# Altium project FPGA_Module.PrjPcb
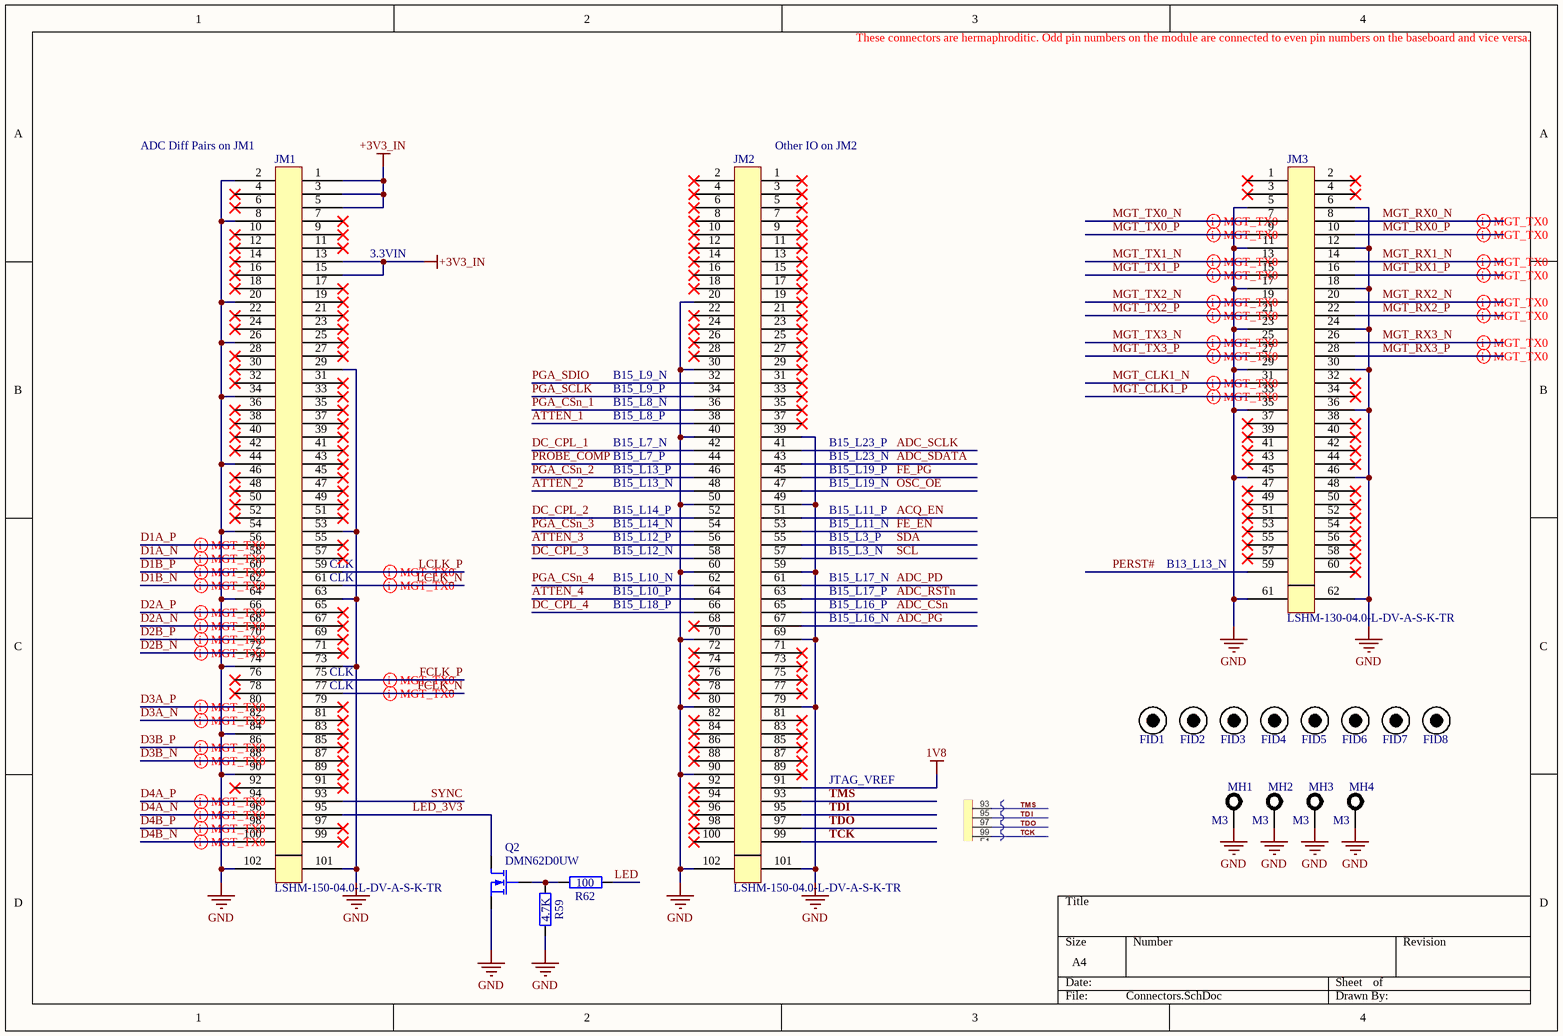
[diagram p0: Connectors.SchDoc]
8 sheets, 195 parts. Net scope: global (net labels, ports and power ports of the same name join across sheets).
Board files: FPGA_Module.PcbDoc, FPGA_Module_Panel.PcbDoc
Sheets:
  Connectors.SchDoc
  FPGA_Bank_IO.SchDoc
  FPGA_Banks_DDR3.SchDoc
  FPGA_MGT.SchDoc
  FPGA_CFG.SchDoc
  FPGA_PWR.SchDoc
  DDR3L.SchDoc
  PWR.SchDoc

## Sheet Connectors.SchDoc
size A4; SheetNumber: 1; SheetTotal: 8

### Parts
FID1  PCB  [GEN_FID]  (value not drawn)  (no BOM)
FID2  PCB  [GEN_FID]  (value not drawn)  (no BOM)
FID3  PCB  [GEN_FID]  (value not drawn)  (no BOM)
FID4  PCB  [GEN_FID]  (value not drawn)  (no BOM)
FID5  PCB  [GEN_FID]  (value not drawn)  (no BOM)
FID6  PCB  [GEN_FID]  (value not drawn)  (no BOM)
FID7  PCB  [GEN_FID]  (value not drawn)  (no BOM)
FID8  PCB  [GEN_FID]  (value not drawn)  (no BOM)
JM1  LSHM-150-04.0-L-DV-A-S-K-TR  [SAM_LSHM-150-XX.X-XX-DV-A-S]
JM2  LSHM-150-04.0-L-DV-A-S-K-TR  [SAM_LSHM-150-XX.X-XX-DV-A-S]
JM3  LSHM-130-04.0-L-DV-A-S-K-TR  [SAM_LSHM-130-XX.X-XX-DV-A-S]
MH1  M3  [MH M3]  (no BOM)
MH2  M3  [MH M3]  (no BOM)
MH3  M3  [MH M3]  (no BOM)
MH4  M3  [MH M3]  (no BOM)
Q2  DMN62D0UW  [GEN_SOT_323]
R59  4.7K  [GEN_R_0201]
R62  100  [GEN_R_0201]

### Nets
1V8: JM2.91
+3V3_IN: JM1.1 JM1.3 JM1.5 JM1.13 JM1.15
GND: JM1.2 JM1.8 JM1.20 JM1.26 JM1.29 JM1.34 JM1.44 JM1.53 JM1.54 JM1.63 JM1.64 JM1.73 JM1.74 JM1.84 JM1.90 JM1.101 JM1.102 JM2.20 JM2.30 JM2.39 JM2.40 JM2.49 JM2.50 JM2.59 JM2.60 JM2.69 JM2.70 JM2.79 JM2.80 JM2.90 JM2.101 JM2.102 JM3.5 JM3.6 JM3.11 JM3.12 JM3.17 JM3.18 JM3.23 JM3.24 JM3.29 JM3.30 JM3.35 JM3.36 JM3.45 JM3.46 JM3.61 JM3.62 MH1.1 MH2.1 MH3.1 MH4.1 Q2.3(S) R59.2
ACQ_EN: JM2.51
ADC_CSn: JM2.65
ADC_PD: JM2.61
ADC_PG: JM2.67
ADC_RSTn: JM2.63
ADC_SCLK: JM2.41
ADC_SDATA: JM2.43
ATTEN_1: JM2.38
ATTEN_2: JM2.48
ATTEN_3: JM2.56
ATTEN_4: JM2.64
D1A_N: JM1.58
D1A_P: JM1.56
D1B_N: JM1.62
D1B_P: JM1.60
D2A_N: JM1.68
D2A_P: JM1.66
D2B_N: JM1.72
D2B_P: JM1.70
D3A_N: JM1.82
D3A_P: JM1.80
D3B_N: JM1.88
D3B_P: JM1.86
D4A_N: JM1.96
D4A_P: JM1.94
D4B_N: JM1.100
D4B_P: JM1.98
DC_CPL_1: JM2.42
DC_CPL_2: JM2.52
DC_CPL_3: JM2.58
DC_CPL_4: JM2.66
FCLK_N: JM1.77
FCLK_P: JM1.75
FE_EN: JM2.53
FE_PG: JM2.45
LCLK_N: JM1.61
LCLK_P: JM1.59
LED: R62.1
LED_3V3: JM1.95 Q2.1(D)
MGT_CLK1_N: JM3.31
MGT_CLK1_P: JM3.33
MGT_RX0_N: JM3.8
MGT_RX0_P: JM3.10
MGT_RX1_N: JM3.14
MGT_RX1_P: JM3.16
MGT_RX2_N: JM3.20
MGT_RX2_P: JM3.22
MGT_RX3_N: JM3.26
MGT_RX3_P: JM3.28
MGT_TX0_N: JM3.7
MGT_TX0_P: JM3.9
MGT_TX1_N: JM3.13
MGT_TX1_P: JM3.15
MGT_TX2_N: JM3.19
MGT_TX2_P: JM3.21
MGT_TX3_N: JM3.25
MGT_TX3_P: JM3.27
OSC_OE: JM2.47
PERST#: JM3.59
PGA_CSn_1: JM2.36
PGA_CSn_2: JM2.46
PGA_CSn_3: JM2.54
PGA_CSn_4: JM2.62
PGA_SCLK: JM2.34
PGA_SDIO: JM2.32
PROBE_COMP: JM2.44
SCL: JM2.57
SDA: JM2.55
SYNC: JM1.93
TCK: JM2.99
TDI: JM2.95
TDO: JM2.97
TMS: JM2.93
NetQ2_2: Q2.2(G) R59.1 R62.2

Not connected (* = marked no-connect by the designer): JM1 4* 6* 7* 9* 10* 11* 12* 14* 16* 17* 18* 19* 21* 22* 23* 24* 25* 27* 28* 30* 31* 32* 33* 35* 36* 37* 38* 39* 40* 41* 42* 43* 45* 46* 47* 48* 49* 50* 51* 52* 55* 57* 65* 67* 69* 71* 76* 78* 79* 81* 83* 85* 87* 89* 91* 92* 97* 99*; JM2 1* 2* 3* 4* 5* 6* 7* 8* 9* 10* 11* 12* 13* 14* 15* 16* 17* 18* 19* 21* 22* 23* 24* 25* 26* 27* 28* 29* 31* 33* 35* 37* 68* 71* 72* 73* 74* 75* 76* 77* 78* 81* 82* 83* 84* 85* 86* 87* 88* 89* 92* 94* 96* 98* 100*; JM3 1* 2* 3* 4* 32* 34* 37* 38* 39* 40* 41* 42* 43* 44* 47* 48* 49* 50* 51* 52* 53* 54* 55* 56* 57* 58* 60*

### Layout directives
differential pair; differential pair class PCIe: MGT_CLK1_N, MGT_CLK1_P, MGT_RX0_N, MGT_RX0_P, MGT_RX1_N, MGT_RX1_P, MGT_RX2_N, MGT_RX2_P, MGT_RX3_N, MGT_RX3_P, MGT_TX0_N, MGT_TX0_P, MGT_TX1_N, MGT_TX1_P, MGT_TX2_N, MGT_TX2_P, MGT_TX3_N, MGT_TX3_P
differential pair; differential pair class ADC LVDS: D1A_N, D1A_P, D1B_N, D1B_P, D2A_N, D2A_P, D2B_N, D2B_P, D3A_N, D3A_P, D3B_N, D3B_P, D4A_N, D4A_P, D4B_N, D4B_P, FCLK_N, FCLK_P, LCLK_N, LCLK_P

### Notes on the sheet
- These connectors are hermaphroditic. Odd pin numbers on the module are connected to even pin numbers on the baseboard and vice versa.
- (near JM1) ADC Diff Pairs on JM1
- (near JM2) Other IO on JM2
- 3.3VIN
- B15_L9_N
- B15_L9_P
- B15_L8_N
- B15_L8_P
- B15_L7_N
- B15_L23_P
- B15_L7_P
- B15_L13_P
- B15_L13_N
- B15_L14_P
- B15_L23_N
- B15_L19_P
- B15_L19_N
- B15_L11_P
- (near JM1) CLK
- B15_L14_N
- B15_L12_P
- B15_L12_N
- B15_L10_N
- B15_L11_N
- B15_L3_P
- B15_L3_N
- B15_L17_N
- B13_L13_N
- B15_L10_P
- B15_L18_P
- B15_L17_P
- B15_L16_P
- B15_L16_N
- JTAG_VREF

### Library data of the parts
FID1-FID8 = FID 1mm
JM1 JM2 = CONN LSHM-150-04.0-L-DV-A-S-K-TR: Supplier 1: Digi-Key; Supplier Part Number 1: SAM9033CT-ND
JM3 = CONN LSHM-130-04.0-L-DV-A-S-K-TR: Supplier 1: Digi-Key; Supplier Part Number 1: SAM9034CT-ND
MH1-MH4 = MH M3
Q2 = NMOS DMN62D0UW: Vdss: 60V; Id: 340mA; Max Power: 320mW; Supplier 1: Digi-Key; Supplier Part Number 1: DMN62D0UW-7DICT-ND
R59 = RES 4.7K OHM 1% 1/20W 0201: Tolerance: 1%; Power Rating: 0.05W; Package: 0201; Value: 4.7K; Supplier 1: Digi-Key; Supplier Part Number 1: 311-4.70KMTR-ND
R62 = RES 100 OHM 1% 1/20W 0201: Tolerance: 1%; Power Rating: 0.05W; Package: 0201; Value: 100; Supplier 1: Digi-Key; Supplier Part Number 1: 311-100MCT-ND

## Sheet FPGA_Bank_IO.SchDoc
size A4; SheetNumber: 2; SheetTotal: 8
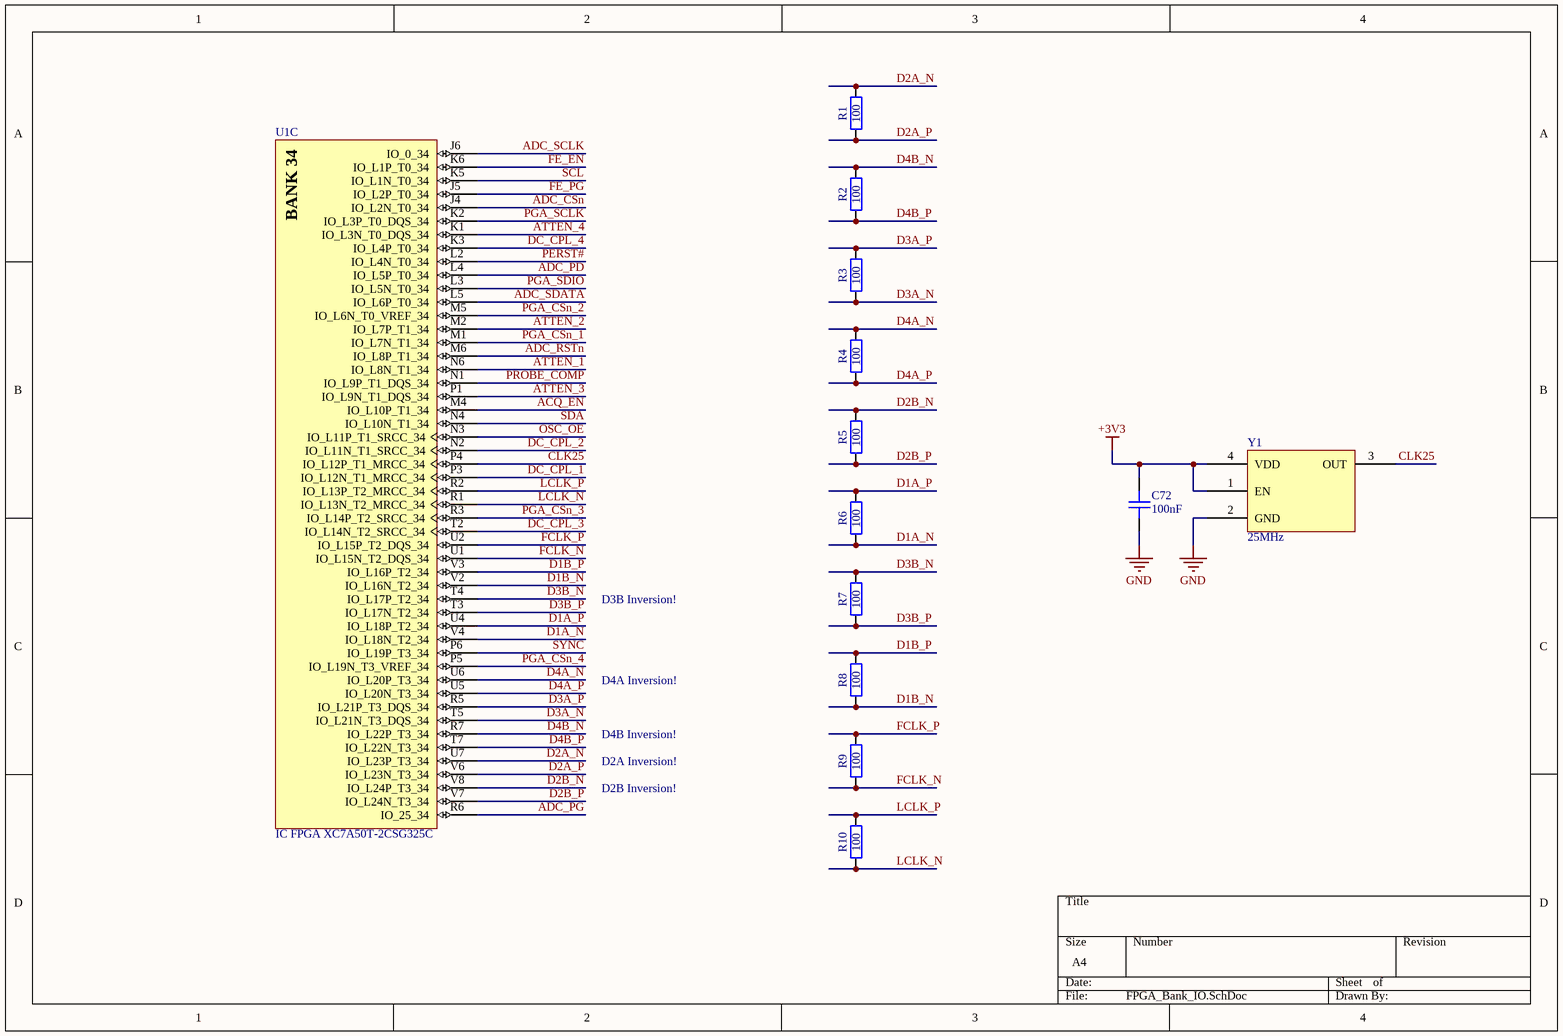
[diagram p1: FPGA_Bank_IO.SchDoc]

### Parts
C72  100nF  [GEN_C_0402]
R1  100  [GEN_R_0201]
R2  100  [GEN_R_0201]
R3  100  [GEN_R_0201]
R4  100  [GEN_R_0201]
R5  100  [GEN_R_0201]
R6  100  [GEN_R_0201]
R7  100  [GEN_R_0201]
R8  100  [GEN_R_0201]
R9  100  [GEN_R_0201]
R10  100  [GEN_R_0201]
U1  IC FPGA XC7A50T-2CSG325C  [XILINX_XC7A50T-2CSG325C]  (part C of 9)
Y1  25MHz  [ECS_TXO-2016]

### Nets
+3V3: C72.1 Y1.1(EN) Y1.4(VDD)
GND: C72.2 Y1.2(GND)
ACQ_EN: U1.M4(IO_L10P_T1_34)
ADC_CSn: U1.J4(IO_L2N_T0_34)
ADC_PD: U1.L4(IO_L5P_T0_34)
ADC_PG: U1.R6(IO_25_34)
ADC_RSTn: U1.M6(IO_L8P_T1_34)
ADC_SCLK: U1.J6(IO_0_34)
ADC_SDATA: U1.L5(IO_L6P_T0_34)
ATTEN_1: U1.N6(IO_L8N_T1_34)
ATTEN_2: U1.M2(IO_L7P_T1_34)
ATTEN_3: U1.P1(IO_L9N_T1_DQS_34)
ATTEN_4: U1.K1(IO_L3N_T0_DQS_34)
CLK25: U1.P4(IO_L12P_T1_MRCC_34) Y1.3(OUT)
D1A_N: R6.1 U1.V4(IO_L18N_T2_34)
D1A_P: R6.2 U1.U4(IO_L18P_T2_34)
D1B_N: R8.1 U1.V2(IO_L16N_T2_34)
D1B_P: R8.2 U1.V3(IO_L16P_T2_34)
D2A_N: R1.2 U1.U7(IO_L23P_T3_34)
D2A_P: R1.1 U1.V6(IO_L23N_T3_34)
D2B_N: R5.2 U1.V8(IO_L24P_T3_34)
D2B_P: R5.1 U1.V7(IO_L24N_T3_34)
D3A_N: R3.1 U1.T5(IO_L21N_T3_DQS_34)
D3A_P: R3.2 U1.R5(IO_L21P_T3_DQS_34)
D3B_N: R7.2 U1.T4(IO_L17P_T2_34)
D3B_P: R7.1 U1.T3(IO_L17N_T2_34)
D4A_N: R4.2 U1.U6(IO_L20P_T3_34)
D4A_P: R4.1 U1.U5(IO_L20N_T3_34)
D4B_N: R2.2 U1.R7(IO_L22P_T3_34)
D4B_P: R2.1 U1.T7(IO_L22N_T3_34)
DC_CPL_1: U1.P3(IO_L12N_T1_MRCC_34)
DC_CPL_2: U1.N2(IO_L11N_T1_SRCC_34)
DC_CPL_3: U1.T2(IO_L14N_T2_SRCC_34)
DC_CPL_4: U1.K3(IO_L4P_T0_34)
FCLK_N: R9.1 U1.U1(IO_L15N_T2_DQS_34)
FCLK_P: R9.2 U1.U2(IO_L15P_T2_DQS_34)
FE_EN: U1.K6(IO_L1P_T0_34)
FE_PG: U1.J5(IO_L2P_T0_34)
LCLK_N: R10.1 U1.R1(IO_L13N_T2_MRCC_34)
LCLK_P: R10.2 U1.R2(IO_L13P_T2_MRCC_34)
OSC_OE: U1.N3(IO_L11P_T1_SRCC_34)
PERST#: U1.L2(IO_L4N_T0_34)
PGA_CSn_1: U1.M1(IO_L7N_T1_34)
PGA_CSn_2: U1.M5(IO_L6N_T0_VREF_34)
PGA_CSn_3: U1.R3(IO_L14P_T2_SRCC_34)
PGA_CSn_4: U1.P5(IO_L19N_T3_VREF_34)
PGA_SCLK: U1.K2(IO_L3P_T0_DQS_34)
PGA_SDIO: U1.L3(IO_L5N_T0_34)
PROBE_COMP: U1.N1(IO_L9P_T1_DQS_34)
SCL: U1.K5(IO_L1N_T0_34)
SDA: U1.N4(IO_L10N_T1_34)
SYNC: U1.P6(IO_L19P_T3_34)

### Notes on the sheet
- D3B Inversion!
- D4A Inversion!
- D4B Inversion!
- D2B Inversion!
- D2A Inversion!
- (in symbol IC FPGA XC7A50T-2CSG325C, part C) BANK 34
- (in symbol IC FPGA XC7A50T-2CSG325C, part A) BANK 14
- (in symbol IC FPGA XC7A50T-2CSG325C, part B) BANK 15
- (in symbol XC7A35T-2CSG325C, part C) BANK 34

### Library data of the parts
C72 = CAP 100nF 16V X7R 0402: Voltage Rating: 16V; Package: 0402; Supplier 1: Digi-Key; Supplier Part Number 1: 490-4759-1-ND; Value: 100nF
R1-R10 = RES 100 OHM 1% 1/20W 0201: Tolerance: 1%; Power Rating: 0.05W; Package: 0201; Value: 100; Supplier 1: Digi-Key; Supplier Part Number 1: 311-100MCT-ND
U1 = IC FPGA XC7A50T-2CSG325C: Artix-7 FPGA, 150 User I/Os, 4 GTP, 324-Ball BGA, Speed Grade 2, Commercial Grade, Pb-Free; Manufacturer: Xilinx; Total Block RAM: 1800 Kb; GTP: 4; Clock Mgmt Tiles (CMTs): 5; Logic Cells: 33280; Available User I/O: 150; Speed Grades: 2; NexusDeviceID: XC7A35T-2CSG325C; DatasheetVersion: v1.15; PackageVersion: Rev. 1.11; PackageReference: CSG-325; PackageDescription: 324-Ball Wire-Bond Chip-Scale BGA, Body 15 x 15 mm, Pitch 0.8 mm; Maximum Distributed RAM: 400 Kb; Operating Temperature Range: Commercial; Mounting Technology: Surface Mount; PartNumber: XC7A35T-2CSG325C; ComponentLink1Description: Manufacturer URL; ComponentLink1URL: http://www.xilinx.com/; ComponentLink2Description: Datasheet; ComponentLink2URL: http://www.xilinx.com/support/documentation/data_sheets/ds180_7Series_Overview.pdf; ComponentLink3Description: Package Specification; ComponentLink3URL: http://www.xilinx.com/support/documentation/user_guides/ug475_7Series_Pkg_Pinout.pdf; ComponentLink4Description: DC and Switching Characteristics; ComponentLink4URL: http://www.xilinx.com/support/documentation/data_sheets/ds181_Artix_7_Data_Sheet.pdf; ComponentLink5Description: Package File; ComponentLink5URL: http://www.xilinx.com/support/packagefiles/a7packages/xc7a200tsbg484pkg.txt; ComponentLink6Description: Packaging and Pinout; ComponentLink6URL: http://www.xilinx.com/support/documentation/user_guides/ug475_7Series_Pkg_Pinout.pdf
Y1 = OSC 25MHz ECS-TXO-2016: Supplier 1: Digi-Key; Supplier Part Number 1: XC3163CT-ND

## Sheet FPGA_Banks_DDR3.SchDoc
size A4; SheetNumber: 3; SheetTotal: 8
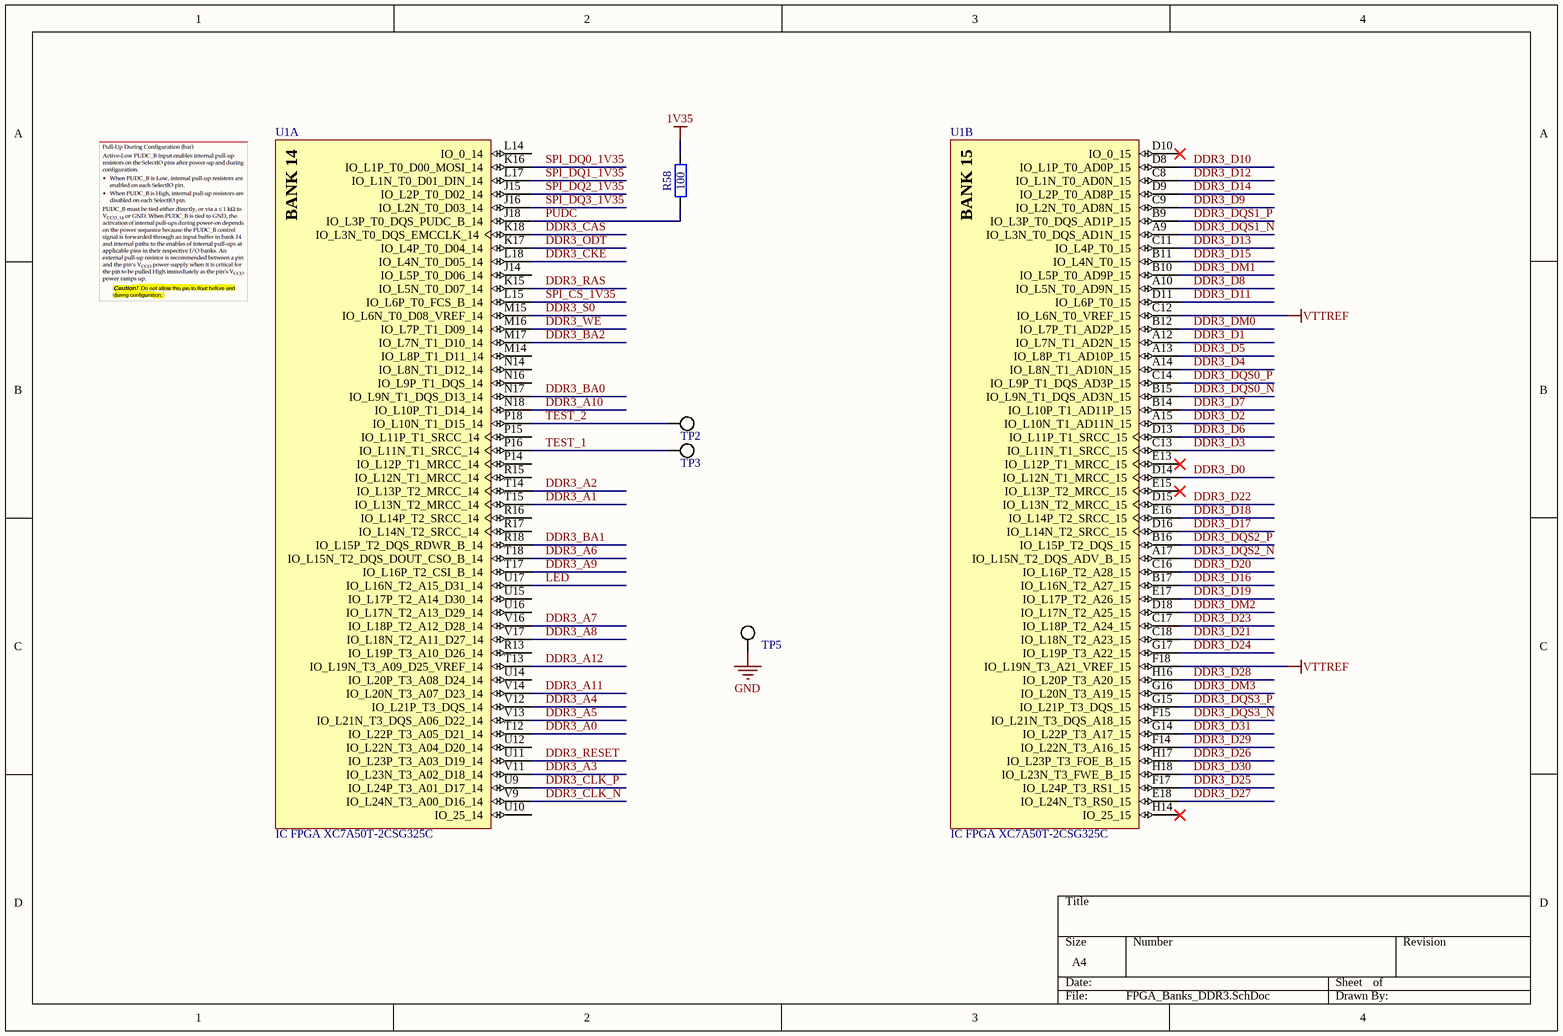
[diagram p2: FPGA_Banks_DDR3.SchDoc]

### Parts
R58  100  [GEN_R_0201]
TP2  PCB  [GEN_TP_PCB]  (value not drawn)  (no BOM)
TP3  PCB  [GEN_TP_PCB]  (value not drawn)  (no BOM)
TP5  PCB  [GEN_TP_PCB]  (value not drawn)  (no BOM)
U1  IC FPGA XC7A50T-2CSG325C  [XILINX_XC7A50T-2CSG325C]  (parts A,B of 9)

### Nets
1V35: R58.2
GND: TP5.1
VTTREF: U1.C12(IO_L6N_T0_VREF_15) U1.F18(IO_L19N_T3_A21_VREF_15)
DDR3_A0: U1.T12(IO_L22P_T3_A05_D21_14)
DDR3_A1: U1.T15(IO_L13N_T2_MRCC_14)
DDR3_A2: U1.T14(IO_L13P_T2_MRCC_14)
DDR3_A3: U1.V11(IO_L23N_T3_A02_D18_14)
DDR3_A4: U1.V12(IO_L21P_T3_DQS_14)
DDR3_A5: U1.V13(IO_L21N_T3_DQS_A06_D22_14)
DDR3_A6: U1.T18(IO_L15N_T2_DQS_DOUT_CSO_B_14)
DDR3_A7: U1.V16(IO_L18P_T2_A12_D28_14)
DDR3_A8: U1.V17(IO_L18N_T2_A11_D27_14)
DDR3_A9: U1.T17(IO_L16P_T2_CSI_B_14)
DDR3_A10: U1.N18(IO_L10P_T1_D14_14)
DDR3_A11: U1.V14(IO_L20N_T3_A07_D23_14)
DDR3_A12: U1.T13(IO_L19N_T3_A09_D25_VREF_14)
DDR3_BA0: U1.N17(IO_L9N_T1_DQS_D13_14)
DDR3_BA1: U1.R18(IO_L15P_T2_DQS_RDWR_B_14)
DDR3_BA2: U1.M17(IO_L7N_T1_D10_14)
DDR3_CAS: U1.K18(IO_L3N_T0_DQS_EMCCLK_14)
DDR3_CKE: U1.L18(IO_L4N_T0_D05_14)
DDR3_CLK_N: U1.V9(IO_L24N_T3_A00_D16_14)
DDR3_CLK_P: U1.U9(IO_L24P_T3_A01_D17_14)
DDR3_D0: U1.D14(IO_L12N_T1_MRCC_15)
DDR3_D1: U1.A12(IO_L7N_T1_AD2N_15)
DDR3_D2: U1.A15(IO_L10N_T1_AD11N_15)
DDR3_D3: U1.C13(IO_L11N_T1_SRCC_15)
DDR3_D4: U1.A14(IO_L8N_T1_AD10N_15)
DDR3_D5: U1.A13(IO_L8P_T1_AD10P_15)
DDR3_D6: U1.D13(IO_L11P_T1_SRCC_15)
DDR3_D7: U1.B14(IO_L10P_T1_AD11P_15)
DDR3_D8: U1.A10(IO_L5N_T0_AD9N_15)
DDR3_D9: U1.C9(IO_L2N_T0_AD8N_15)
DDR3_D10: U1.D8(IO_L1P_T0_AD0P_15)
DDR3_D11: U1.D11(IO_L6P_T0_15)
DDR3_D12: U1.C8(IO_L1N_T0_AD0N_15)
DDR3_D13: U1.C11(IO_L4P_T0_15)
DDR3_D14: U1.D9(IO_L2P_T0_AD8P_15)
DDR3_D15: U1.B11(IO_L4N_T0_15)
DDR3_D16: U1.B17(IO_L16N_T2_A27_15)
DDR3_D17: U1.D16(IO_L14N_T2_SRCC_15)
DDR3_D18: U1.E16(IO_L14P_T2_SRCC_15)
DDR3_D19: U1.E17(IO_L17P_T2_A26_15)
DDR3_D20: U1.C16(IO_L16P_T2_A28_15)
DDR3_D21: U1.C18(IO_L18N_T2_A23_15)
DDR3_D22: U1.D15(IO_L13N_T2_MRCC_15)
DDR3_D23: U1.C17(IO_L18P_T2_A24_15)
DDR3_D24: U1.G17(IO_L19P_T3_A22_15)
DDR3_D25: U1.F17(IO_L24P_T3_RS1_15)
DDR3_D26: U1.H17(IO_L23P_T3_FOE_B_15)
DDR3_D27: U1.E18(IO_L24N_T3_RS0_15)
DDR3_D28: U1.H16(IO_L20P_T3_A20_15)
DDR3_D29: U1.F14(IO_L22N_T3_A16_15)
DDR3_D30: U1.H18(IO_L23N_T3_FWE_B_15)
DDR3_D31: U1.G14(IO_L22P_T3_A17_15)
DDR3_DM0: U1.B12(IO_L7P_T1_AD2P_15)
DDR3_DM1: U1.B10(IO_L5P_T0_AD9P_15)
DDR3_DM2: U1.D18(IO_L17N_T2_A25_15)
DDR3_DM3: U1.G16(IO_L20N_T3_A19_15)
DDR3_DQS0_N: U1.B15(IO_L9N_T1_DQS_AD3N_15)
DDR3_DQS0_P: U1.C14(IO_L9P_T1_DQS_AD3P_15)
DDR3_DQS1_N: U1.A9(IO_L3N_T0_DQS_AD1N_15)
DDR3_DQS1_P: U1.B9(IO_L3P_T0_DQS_AD1P_15)
DDR3_DQS2_N: U1.A17(IO_L15N_T2_DQS_ADV_B_15)
DDR3_DQS2_P: U1.B16(IO_L15P_T2_DQS_15)
DDR3_DQS3_N: U1.F15(IO_L21N_T3_DQS_A18_15)
DDR3_DQS3_P: U1.G15(IO_L21P_T3_DQS_15)
DDR3_ODT: U1.K17(IO_L4P_T0_D04_14)
DDR3_RAS: U1.K15(IO_L5N_T0_D07_14)
DDR3_RESET: U1.U11(IO_L23P_T3_A03_D19_14)
DDR3_S0: U1.M15(IO_L6N_T0_D08_VREF_14)
DDR3_WE: U1.M16(IO_L7P_T1_D09_14)
LED: U1.U17(IO_L16N_T2_A15_D31_14)
PUDC: R58.1 U1.J18(IO_L3P_T0_DQS_PUDC_B_14)
SPI_CS_1V35: U1.L15(IO_L6P_T0_FCS_B_14)
SPI_DQ0_1V35: U1.K16(IO_L1P_T0_D00_MOSI_14)
SPI_DQ1_1V35: U1.L17(IO_L1N_T0_D01_DIN_14)
SPI_DQ2_1V35: U1.J15(IO_L2P_T0_D02_14)
SPI_DQ3_1V35: U1.J16(IO_L2N_T0_D03_14)
TEST_1: TP3.1 U1.P16(IO_L11N_T1_SRCC_14)
TEST_2: TP2.1 U1.P18(IO_L10N_T1_D15_14)

Not connected (* = marked no-connect by the designer): U1 D10(IO_0_15)* E13(IO_L12P_T1_MRCC_15)* E15(IO_L13P_T2_MRCC_15)* H14(IO_25_15)* J14(IO_L5P_T0_D06_14) L14(IO_0_14) M14(IO_L8P_T1_D11_14) N14(IO_L8N_T1_D12_14) N16(IO_L9P_T1_DQS_14) P14(IO_L12P_T1_MRCC_14) P15(IO_L11P_T1_SRCC_14) R13(IO_L19P_T3_A10_D26_14) R15(IO_L12N_T1_MRCC_14) R16(IO_L14P_T2_SRCC_14) R17(IO_L14N_T2_SRCC_14) U10(IO_25_14) U12(IO_L22N_T3_A04_D20_14) U14(IO_L20P_T3_A08_D24_14) U15(IO_L17P_T2_A14_D30_14) U16(IO_L17N_T2_A13_D29_14)

### Notes on the sheet
- (in symbol IC FPGA XC7A50T-2CSG325C, part A) BANK 14
- (in symbol IC FPGA XC7A50T-2CSG325C, part B) BANK 15
- (in symbol XC7A35T-2CSG325C, part A) BANK 14
- (in symbol XC7A35T-2CSG325C, part B) BANK 15

### Library data of the parts
R58 = RES 100 OHM 1% 1/20W 0201: Tolerance: 1%; Power Rating: 0.05W; Package: 0201; Value: 100; Supplier 1: Digi-Key; Supplier Part Number 1: 311-100MCT-ND
TP2 TP3 TP5 = TP PCB 1mm
U1 = IC FPGA XC7A50T-2CSG325C: as U1 on sheet FPGA_Bank_IO; DatasheetVersion: v1.15; PackageVersion: Rev. 1.11; PackageReference: CSG-325; PackageDescription: 324-Ball Wire-Bond Chip-Scale BGA, Body 15 x 15 mm, Pitch 0.8 mm; Maximum Distributed RAM: 400 Kb; Operating Temperature Range: Commercial; Mounting Technology: Surface Mount; PartNumber: XC7A35T-2CSG325C; ComponentLink1Description: Manufacturer URL; ComponentLink1URL: http://www.xilinx.com/; ComponentLink2Description: Datasheet; ComponentLink2URL: http://www.xilinx.com/support/documentation/data_sheets/ds180_7Series_Overview.pdf; ComponentLink3Description: Package Specification; ComponentLink3URL: http://www.xilinx.com/support/documentation/user_guides/ug475_7Series_Pkg_Pinout.pdf; ComponentLink4Description: DC and Switching Characteristics; ComponentLink4URL: http://www.xilinx.com/support/documentation/data_sheets/ds181_Artix_7_Data_Sheet.pdf; ComponentLink5Description: Package File; ComponentLink5URL: http://www.xilinx.com/support/packagefiles/a7packages/xc7a200tsbg484pkg.txt; ComponentLink6Description: Packaging and Pinout; ComponentLink6URL: http://www.xilinx.com/support/documentation/user_guides/ug475_7Series_Pkg_Pinout.pdf

## Sheet FPGA_MGT.SchDoc
size A4; SheetNumber: 4; SheetTotal: 8
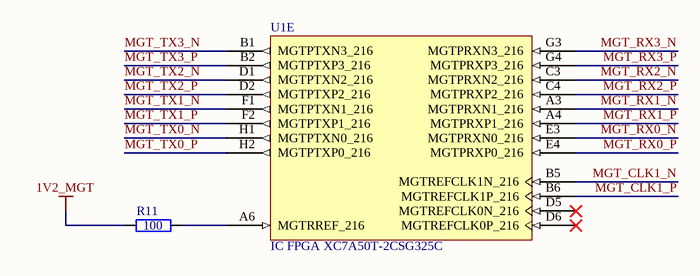
[diagram p3: FPGA_MGT.SchDoc]

### Parts
R11  100  [GEN_R_0201]
U1  IC FPGA XC7A50T-2CSG325C  [XILINX_XC7A50T-2CSG325C]  (part E of 9)

### Nets
1V2_MGT: R11.1
MGT_CLK1_N: U1.B5(MGTREFCLK1N_216)
MGT_CLK1_P: U1.B6(MGTREFCLK1P_216)
MGT_RX0_N: U1.E3(MGTPRXN0_216)
MGT_RX0_P: U1.E4(MGTPRXP0_216)
MGT_RX1_N: U1.A3(MGTPRXN1_216)
MGT_RX1_P: U1.A4(MGTPRXP1_216)
MGT_RX2_N: U1.C3(MGTPRXN2_216)
MGT_RX2_P: U1.C4(MGTPRXP2_216)
MGT_RX3_N: U1.G3(MGTPRXN3_216)
MGT_RX3_P: U1.G4(MGTPRXP3_216)
MGT_TX0_N: U1.H1(MGTPTXN0_216)
MGT_TX0_P: U1.H2(MGTPTXP0_216)
MGT_TX1_N: U1.F1(MGTPTXN1_216)
MGT_TX1_P: U1.F2(MGTPTXP1_216)
MGT_TX2_N: U1.D1(MGTPTXN2_216)
MGT_TX2_P: U1.D2(MGTPTXP2_216)
MGT_TX3_N: U1.B1(MGTPTXN3_216)
MGT_TX3_P: U1.B2(MGTPTXP3_216)
NetR11_2: R11.2 U1.A6(MGTRREF_216)

Not connected (* = marked no-connect by the designer): U1 D5(MGTREFCLK0N_216)* D6(MGTREFCLK0P_216)*

### Library data of the parts
R11 = RES 100 OHM 1% 1/20W 0201: House Part Number: R-100-0201-1%-001; Manufacturer: Yageo; Manufacturer Part Number: RC0201FR-07100RL; Tolerance: 1%; Package: 0201; Value: 100; Supplier 1: Digi-Key; Supplier Part Number 1: 311-100MCT-ND
U1 = IC FPGA XC7A50T-2CSG325C: Artix-7 FPGA, 150 User I/Os, 4 GTP, 324-Ball BGA, Speed Grade 2, Commercial Grade, Pb-Free; Manufacturer: Xilinx; House Part Number: XC7A50T-2CSG325C; Manufacturer Part Number: XC7A50T-2CSG325C; Supplier 1: Digi-Key; Supplier Part Number 1: 122-2193-ND

## Sheet FPGA_CFG.SchDoc
size A4; SheetNumber: 5; SheetTotal: 8
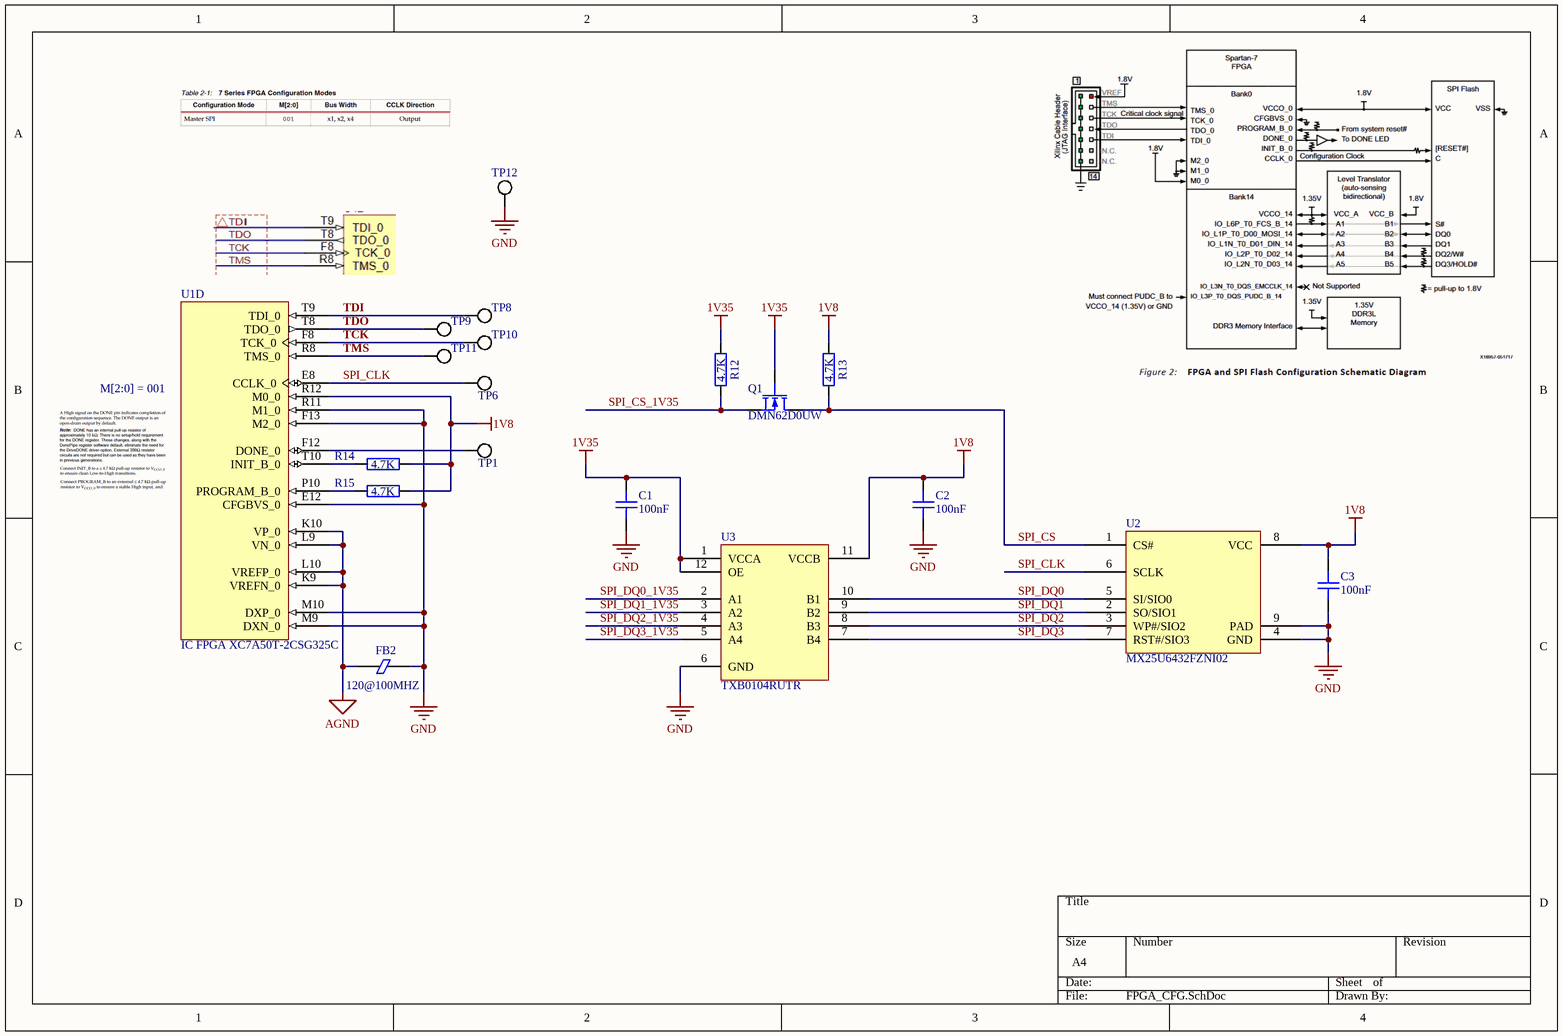
[diagram p4: FPGA_CFG.SchDoc]

### Parts
C1  100nF  [GEN_C_0402]
C2  100nF  [GEN_C_0402]
C3  100nF  [GEN_C_0402]
FB2  120@100MHZ  [GEN_R_0402]
Q1  DMN62D0UW  [GEN_SOT_323]
R12  4.7K  [GEN_R_0201]
R13  4.7K  [GEN_R_0201]
R14  4.7K  [GEN_R_0201]
R15  4.7K  [GEN_R_0201]
TP1  PCB  [GEN_TP_PCB]  (value not drawn)  (no BOM)
TP6  PCB  [GEN_TP_PCB]  (value not drawn)  (no BOM)
TP8  PCB  [GEN_TP_PCB]  (value not drawn)  (no BOM)
TP9  PCB  [GEN_TP_PCB]  (value not drawn)  (no BOM)
TP10  PCB  [GEN_TP_PCB]  (value not drawn)  (no BOM)
TP11  PCB  [GEN_TP_PCB]  (value not drawn)  (no BOM)
TP12  PCB  [GEN_TP_PCB]  (value not drawn)  (no BOM)
U1  IC FPGA XC7A50T-2CSG325C  [XILINX_XC7A50T-2CSG325C]  (part D of 9)
U2  MX25U6432FZNI02  [MX_WSON8]
U3  TXB0104RUTR  [TI_UQFN_RUT0012A]

### Nets
1V8: C2.1 C3.1 R13.2 R14.2 R15.2 U1.R12(M0_0) U2.8(VCC) U3.11(VCCB)
1V35: C1.1 Q1.2(G) R12.2 U3.1(VCCA) U3.12(OE)
AGND: FB2.1 U1.K9(VREFN_0) U1.K10(VP_0) U1.L9(VN_0) U1.L10(VREFP_0)
GND: C1.2 C2.2 C3.2 FB2.2 TP12.1 U1.E12(CFGBVS_0) U1.F13(M2_0) U1.M9(DXN_0) U1.M10(DXP_0) U1.R11(M1_0) U2.4(GND) U2.9(PAD) U3.6(GND)
SPI_CLK: TP6.1 U1.E8(CCLK_0) U2.6(SCLK)
SPI_CS: Q1.1(D) R13.1 U2.1(CS#)
SPI_CS_1V35: Q1.3(S) R12.1
SPI_DQ0: U2.5(SI/SIO0) U3.10(B1)
SPI_DQ0_1V35: U3.2(A1)
SPI_DQ1: U2.2(SO/SIO1) U3.9(B2)
SPI_DQ1_1V35: U3.3(A2)
SPI_DQ2: U2.3(WP#/SIO2) U3.8(B3)
SPI_DQ2_1V35: U3.4(A3)
SPI_DQ3: U2.7(RST#/SIO3) U3.7(B4)
SPI_DQ3_1V35: U3.5(A4)
TCK: TP10.1 U1.F8(TCK_0)
TDI: TP8.1 U1.T9(TDI_0)
TDO: TP9.1 U1.T8(TDO_0)
TMS: TP11.1 U1.R8(TMS_0)
NetR14_1: R14.1 U1.T10(INIT_B_0)
NetR15_1: R15.1 U1.P10(PROGRAM_B_0)
NetTP1_1: TP1.1 U1.F12(DONE_0)

### Notes on the sheet
- M[2:0] = 001

### Library data of the parts
C1-C3 = CAP 100nF 16V X7R 0402: Voltage Rating: 16V; Package: 0402; Supplier 1: Digi-Key; Supplier Part Number 1: 490-4759-1-ND; Value: 100nF
FB2 = FERRITE BEAD 120 OHM 0402: Supplier 1: Digi-Key; Supplier Part Number 1: 490-9656-1-ND
Q1 = NMOS DMN62D0UW: Vdss: 60V; Id: 340mA; Max Power: 320mW; Supplier 1: Digi-Key; Supplier Part Number 1: DMN62D0UW-7DICT-ND
R12-R15 = RES 4.7K OHM 1% 1/20W 0201: Tolerance: 1%; Power Rating: 0.05W; Package: 0201; Supplier 1: Digi-Key; Supplier Part Number 1: 311-4.70KMTR-ND; Value: 4.7K
TP1 TP6 TP8-TP12 = TP PCB 1mm
U1 = IC FPGA XC7A50T-2CSG325C: as U1 on sheet FPGA_Bank_IO; DatasheetVersion: v1.15; PackageVersion: Rev. 1.11; PackageReference: CSG-325; PackageDescription: 324-Ball Wire-Bond Chip-Scale BGA, Body 15 x 15 mm, Pitch 0.8 mm; Maximum Distributed RAM: 400 Kb; Operating Temperature Range: Commercial; Mounting Technology: Surface Mount; PartNumber: XC7A35T-2CSG325C; ComponentLink1Description: Manufacturer URL; ComponentLink1URL: http://www.xilinx.com/; ComponentLink2Description: Datasheet; ComponentLink2URL: http://www.xilinx.com/support/documentation/data_sheets/ds180_7Series_Overview.pdf; ComponentLink3Description: Package Specification; ComponentLink3URL: http://www.xilinx.com/support/documentation/user_guides/ug475_7Series_Pkg_Pinout.pdf; ComponentLink4Description: DC and Switching Characteristics; ComponentLink4URL: http://www.xilinx.com/support/documentation/data_sheets/ds181_Artix_7_Data_Sheet.pdf; ComponentLink5Description: Package File; ComponentLink5URL: http://www.xilinx.com/support/packagefiles/a7packages/xc7a200tsbg484pkg.txt; ComponentLink6Description: Packaging and Pinout; ComponentLink6URL: http://www.xilinx.com/support/documentation/user_guides/ug475_7Series_Pkg_Pinout.pdf
U2 = IC FLASH MX25U6432FZNI02: Supplier 1: Digi-Key; Supplier Part Number 1: 1092-MX25U6432FZNI02-ND
U3 = IC TRNSLTR TXB0104RUTR: Supplier 1: Digi-Key; Supplier Part Number 1: 296-25888-1-ND

## Sheet FPGA_PWR.SchDoc
size A4; SheetNumber: 6; SheetTotal: 8
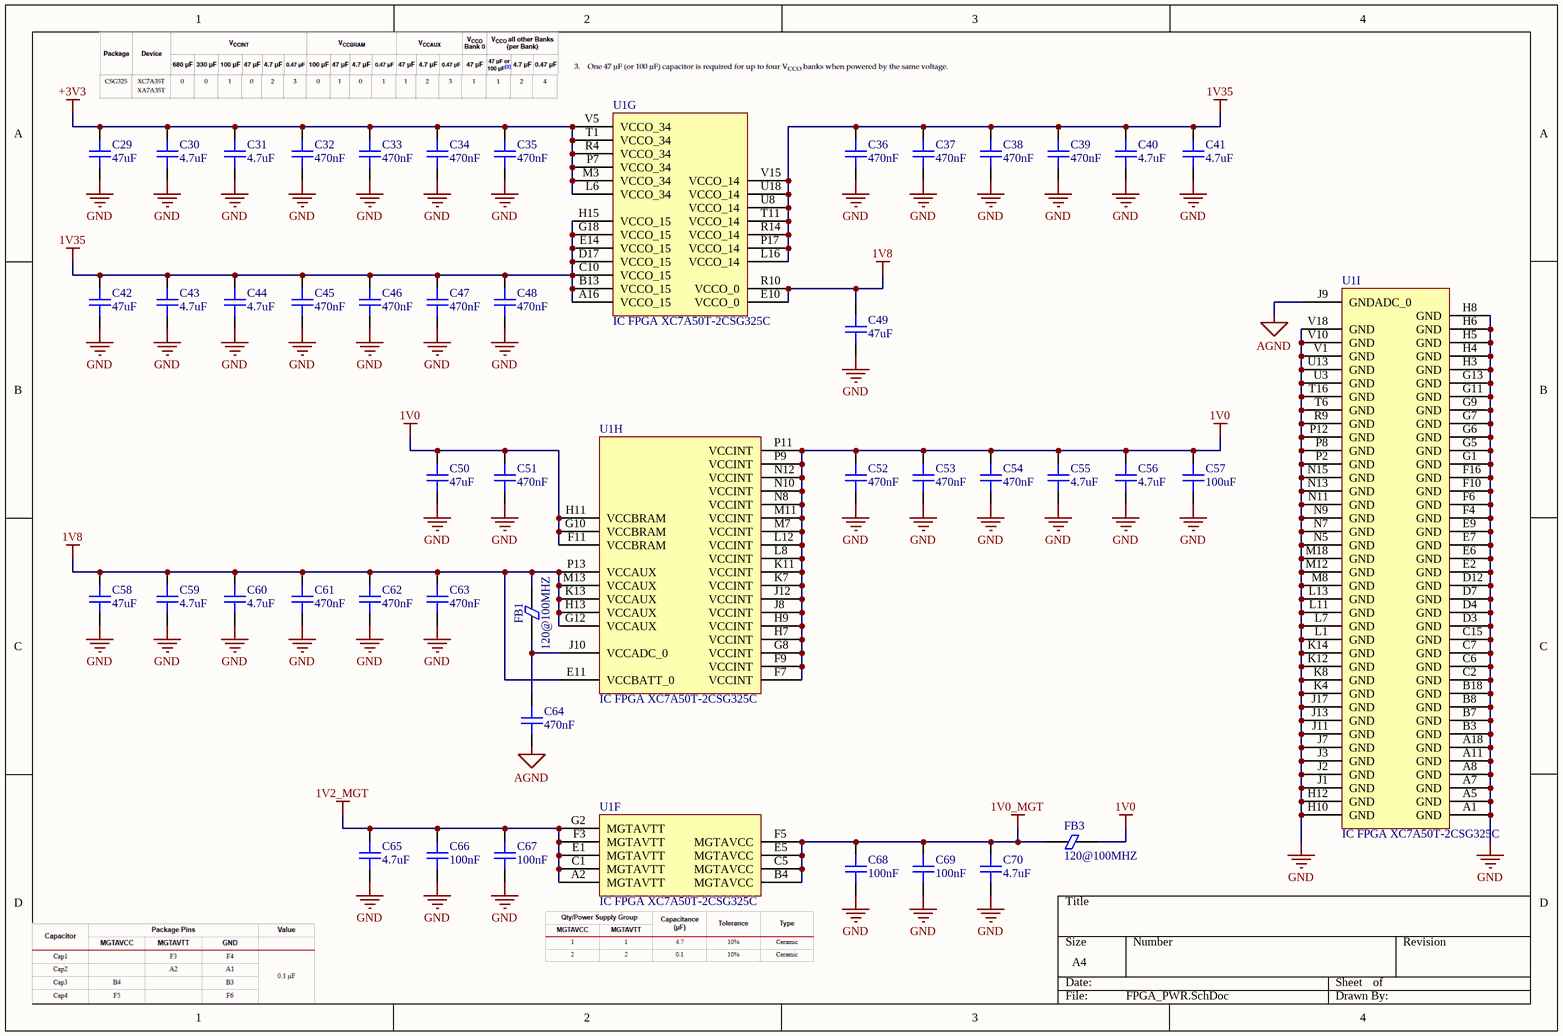
[diagram p5: FPGA_PWR.SchDoc]

### Parts
C29  47uF  [GEN_C_0805]
C30  4.7uF  [GEN_C_0402]
C31  4.7uF  [GEN_C_0402]
C32  470nF  [GEN_C_0201]
C33  470nF  [GEN_C_0201]
C34  470nF  [GEN_C_0201]
C35  470nF  [GEN_C_0201]
C36  470nF  [GEN_C_0201]
C37  470nF  [GEN_C_0201]
C38  470nF  [GEN_C_0201]
C39  470nF  [GEN_C_0201]
C40  4.7uF  [GEN_C_0402]
C41  4.7uF  [GEN_C_0402]
C42  47uF  [GEN_C_0805]
C43  4.7uF  [GEN_C_0402]
C44  4.7uF  [GEN_C_0402]
C45  470nF  [GEN_C_0201]
C46  470nF  [GEN_C_0201]
C47  470nF  [GEN_C_0201]
C48  470nF  [GEN_C_0201]
C49  47uF  [GEN_C_0805]
C50  47uF  [GEN_C_0805]
C51  470nF  [GEN_C_0201]
C52  470nF  [GEN_C_0201]
C53  470nF  [GEN_C_0201]
C54  470nF  [GEN_C_0201]
C55  4.7uF  [GEN_C_0402]
C56  4.7uF  [GEN_C_0402]
C57  100uF  [GEN_C_1210]
C58  47uF  [GEN_C_0805]
C59  4.7uF  [GEN_C_0402]
C60  4.7uF  [GEN_C_0402]
C61  470nF  [GEN_C_0201]
C62  470nF  [GEN_C_0201]
C63  470nF  [GEN_C_0201]
C64  470nF  [GEN_C_0201]
C65  4.7uF  [GEN_C_0402]
C66  100nF  [GEN_C_0201]
C67  100nF  [GEN_C_0201]
C68  100nF  [GEN_C_0201]
C69  100nF  [GEN_C_0201]
C70  4.7uF  [GEN_C_0402]
FB1  120@100MHZ  [GEN_R_0402]
FB3  120@100MHZ  [GEN_R_0402]
U1  IC FPGA XC7A50T-2CSG325C  [XILINX_XC7A50T-2CSG325C]  (parts F,G,H,I of 9)

### Nets
1V0: C50.2 C51.2 C52.2 C53.2 C54.2 C55.2 C56.2 C57.2 FB3.1 U1.F7(VCCINT) U1.F9(VCCINT) U1.F11(VCCBRAM) U1.G8(VCCINT) U1.G10(VCCBRAM) U1.H7(VCCINT) U1.H9(VCCINT) U1.H11(VCCBRAM) U1.J8(VCCINT) U1.J12(VCCINT) U1.K7(VCCINT) U1.K11(VCCINT) U1.L8(VCCINT) U1.L12(VCCINT) U1.M7(VCCINT) U1.M11(VCCINT) U1.N8(VCCINT) U1.N10(VCCINT) U1.N12(VCCINT) U1.P9(VCCINT) U1.P11(VCCINT)
1V0_MGT: C68.2 C69.2 C70.2 FB3.2 U1.B4(MGTAVCC) U1.C5(MGTAVCC) U1.E5(MGTAVCC) U1.F5(MGTAVCC)
1V2_MGT: C65.2 C66.2 C67.2 U1.A2(MGTAVTT) U1.C1(MGTAVTT) U1.E1(MGTAVTT) U1.F3(MGTAVTT) U1.G2(MGTAVTT)
1V8: C49.2 C58.2 C59.2 C60.2 C61.2 C62.2 C63.2 FB1.2 U1.E10(VCCO_0) U1.E11(VCCBATT_0) U1.G12(VCCAUX) U1.H13(VCCAUX) U1.K13(VCCAUX) U1.M13(VCCAUX) U1.P13(VCCAUX) U1.R10(VCCO_0)
1V35: C36.2 C37.2 C38.2 C39.2 C40.2 C41.2 C42.2 C43.2 C44.2 C45.2 C46.2 C47.2 C48.2 U1.A16(VCCO_15) U1.B13(VCCO_15) U1.C10(VCCO_15) U1.D17(VCCO_15) U1.E14(VCCO_15) U1.G18(VCCO_15) U1.H15(VCCO_15) U1.L16(VCCO_14) U1.P17(VCCO_14) U1.R14(VCCO_14) U1.T11(VCCO_14) U1.U8(VCCO_14) U1.U18(VCCO_14) U1.V15(VCCO_14)
+3V3: C29.2 C30.2 C31.2 C32.2 C33.2 C34.2 C35.2 U1.L6(VCCO_34) U1.M3(VCCO_34) U1.P7(VCCO_34) U1.R4(VCCO_34) U1.T1(VCCO_34) U1.V5(VCCO_34)
AGND: C64.1 U1.J9(GNDADC_0)
GND: C29.1 C30.1 C31.1 C32.1 C33.1 C34.1 C35.1 C36.1 C37.1 C38.1 C39.1 C40.1 C41.1 C42.1 C43.1 C44.1 C45.1 C46.1 C47.1 C48.1 C49.1 C50.1 C51.1 C52.1 C53.1 C54.1 C55.1 C56.1 C57.1 C58.1 C59.1 C60.1 C61.1 C62.1 C63.1 C65.1 C66.1 C67.1 C68.1 C69.1 C70.1 U1.A1(GND) U1.A5(GND) U1.A7(GND) U1.A8(GND) U1.A11(GND) U1.A18(GND) U1.B3(GND) U1.B7(GND) U1.B8(GND) U1.B18(GND) U1.C2(GND) U1.C6(GND) U1.C7(GND) U1.C15(GND) U1.D3(GND) U1.D4(GND) U1.D7(GND) U1.D12(GND) U1.E2(GND) U1.E6(GND) U1.E7(GND) U1.E9(GND) U1.F4(GND) U1.F6(GND) U1.F10(GND) U1.F16(GND) U1.G1(GND) U1.G5(GND) U1.G6(GND) U1.G7(GND) U1.G9(GND) U1.G11(GND) U1.G13(GND) U1.H3(GND) U1.H4(GND) U1.H5(GND) U1.H6(GND) U1.H8(GND) U1.H10(GND) U1.H12(GND) U1.J1(GND) U1.J2(GND) U1.J3(GND) U1.J7(GND) U1.J11(GND) U1.J13(GND) U1.J17(GND) U1.K4(GND) U1.K8(GND) U1.K12(GND) U1.K14(GND) U1.L1(GND) U1.L7(GND) U1.L11(GND) U1.L13(GND) U1.M8(GND) U1.M12(GND) U1.M18(GND) U1.N5(GND) U1.N7(GND) U1.N9(GND) U1.N11(GND) U1.N13(GND) U1.N15(GND) U1.P2(GND) U1.P8(GND) U1.P12(GND) U1.R9(GND) U1.T6(GND) U1.T16(GND) U1.U3(GND) U1.U13(GND) U1.V1(GND) U1.V10(GND) U1.V18(GND)
NetC64_2: C64.2 FB1.1 U1.J10(VCCADC_0)

### Library data of the parts
C29 C42 C49 C50 C58 = CAP 47uF 6.3V X5R 0805: House Part Number: C-47uF-0805-002; Manufacturer: Samsung; Manufacturer Part Number: CL21A476MQYNNNE; Voltage Rating: 6.3V; Package: 0805; Value: 47uF; Supplier 1: Digi-Key; Supplier Part Number 1: 1276-1852-1-ND
C30 C31 C40 C41 C43 C44 C55 C56 C59 C60 C65 C70 = CAP 4.7uF 6.3V X5R 0402: House Part Number: C-4.7uF-0402-002; Manufacturer: Murata; Manufacturer Part Number: GRM155R60J475ME47D; Voltage Rating: 6.3V; Package: 0402; Value: 4.7uF; Supplier 1: Digi-Key; Supplier Part Number 1: 490-5915-1-ND
C32-C39 C45-C48 C51-C54 C61-C64 = CAP 470nF 6.3V X5R 0201: House Part Number: C-470nF-0201-002; Manufacturer: Murata; Manufacturer Part Number: GRM033R60J474KE90D; Voltage Rating: 6.3V; Package: 0201; Value: 470nF; Supplier 1: Digi-Key; Supplier Part Number 1: 490-10409-1-ND
C57 = CAP 100uF 6.3V X5R 1210: House Part Number: C-100uF-1210-002; Manufacturer: Samsung; Manufacturer Part Number: CL32A107MQVNNNE; Voltage Rating: 6.3V; Package: 1210; Value: 100uF; Supplier 1: Digi-Key; Supplier Part Number 1: 1276-1092-1-ND
C66-C69 = CAP 100nF 6.3V X5R 0201: House Part Number: C-100nF-0201-002; Manufacturer: Murata; Manufacturer Part Number: GRM033R60J104KE19D; Voltage Rating: 6.3V; Package: 0201; Supplier 1: Digi-Key; Supplier Part Number 1: 490-3167-1-ND; Value: 100nF
FB1 FB3 = FERRITE BEAD 120 OHM 0402: House Part Number: BLM15PX121SN1D; Manufacturer: Murata; Supplier 1: Digi-Key; Supplier Part Number 1: 490-9656-1-ND; Manufacturer Part Number: BLM15PX121SN1D
U1 = IC FPGA XC7A50T-2CSG325C: as U1 on sheet FPGA_MGT; House Part Number: XC7A50T-2CSG325C; Manufacturer Part Number: XC7A50T-2CSG325C; Supplier 1: Digi-Key; Supplier Part Number 1: 122-2193-ND

## Sheet DDR3L.SchDoc
size A4; SheetNumber: 7; SheetTotal: 8
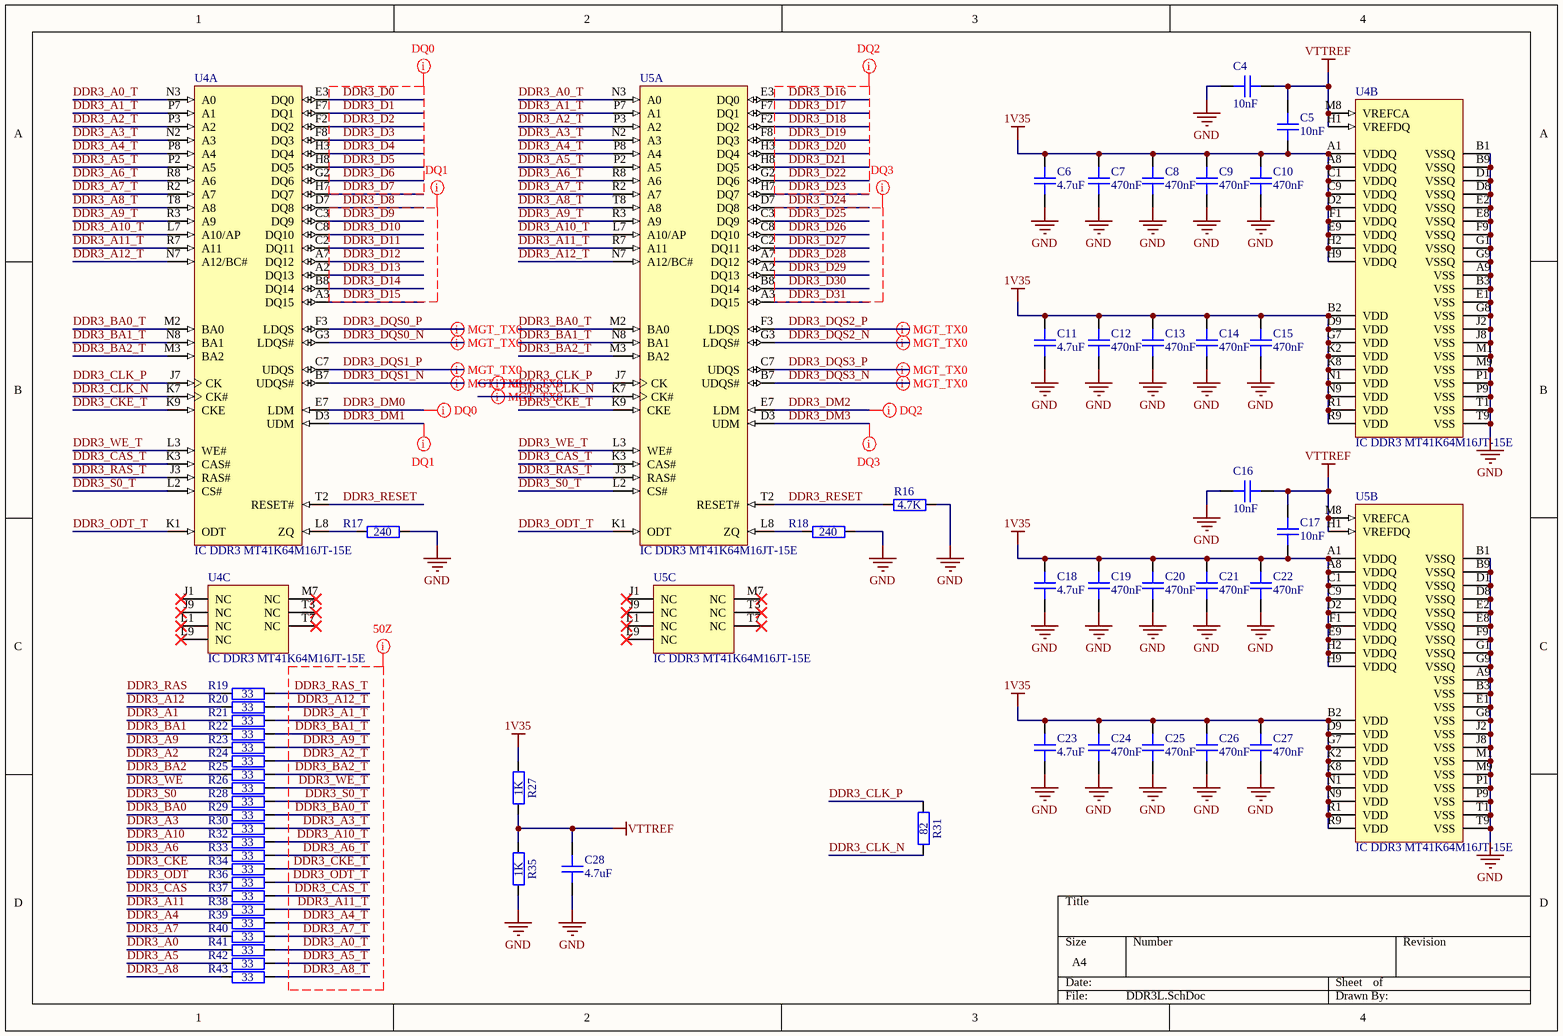
[diagram p6: DDR3L.SchDoc]

### Parts
C4  10nF  [GEN_C_0402]
C5  10nF  [GEN_C_0402]
C6  4.7uF  [GEN_C_0402]
C7  470nF  [GEN_C_0201]
C8  470nF  [GEN_C_0201]
C9  470nF  [GEN_C_0201]
C10  470nF  [GEN_C_0201]
C11  4.7uF  [GEN_C_0402]
C12  470nF  [GEN_C_0201]
C13  470nF  [GEN_C_0201]
C14  470nF  [GEN_C_0201]
C15  470nF  [GEN_C_0201]
C16  10nF  [GEN_C_0402]
C17  10nF  [GEN_C_0402]
C18  4.7uF  [GEN_C_0402]
C19  470nF  [GEN_C_0201]
C20  470nF  [GEN_C_0201]
C21  470nF  [GEN_C_0201]
C22  470nF  [GEN_C_0201]
C23  4.7uF  [GEN_C_0402]
C24  470nF  [GEN_C_0201]
C25  470nF  [GEN_C_0201]
C26  470nF  [GEN_C_0201]
C27  470nF  [GEN_C_0201]
C28  4.7uF  [GEN_C_0402]
R16  4.7K  [GEN_R_0201]
R17  240  [GEN_R_0402]
R18  240  [GEN_R_0402]
R19  33  [GEN_R_0201]
R20  33  [GEN_R_0201]
R21  33  [GEN_R_0201]
R22  33  [GEN_R_0201]
R23  33  [GEN_R_0201]
R24  33  [GEN_R_0201]
R25  33  [GEN_R_0201]
R26  33  [GEN_R_0201]
R27  1K  [GEN_R_0402]
R28  33  [GEN_R_0201]
R29  33  [GEN_R_0201]
R30  33  [GEN_R_0201]
R31  82  [GEN_R_0402]
R32  33  [GEN_R_0201]
R33  33  [GEN_R_0201]
R34  33  [GEN_R_0201]
R35  1K  [GEN_R_0402]
R36  33  [GEN_R_0201]
R37  33  [GEN_R_0201]
R38  33  [GEN_R_0201]
R39  33  [GEN_R_0201]
R40  33  [GEN_R_0201]
R41  33  [GEN_R_0201]
R42  33  [GEN_R_0201]
R43  33  [GEN_R_0201]
U4  IC DDR3 MT41K64M16JT-15E  [MICT-JT-96]  (parts A,B,C of 3)
U5  IC DDR3 MT41K64M16JT-15E  [MICT-JT-96]  (parts A,B,C of 3)

### Nets
1V35: C5.2 C6.2 C7.2 C8.2 C9.2 C10.2 C11.2 C12.2 C13.2 C14.2 C15.2 C17.2 C18.2 C19.2 C20.2 C21.2 C22.2 C23.2 C24.2 C25.2 C26.2 C27.2 R27.2 U4.A1(VDDQ) U4.A8(VDDQ) U4.B2(VDD) U4.C1(VDDQ) U4.C9(VDDQ) U4.D2(VDDQ) U4.D9(VDD) U4.E9(VDDQ) U4.F1(VDDQ) U4.G7(VDD) U4.H2(VDDQ) U4.H9(VDDQ) U4.K2(VDD) U4.K8(VDD) U4.N1(VDD) U4.N9(VDD) U4.R1(VDD) U4.R9(VDD) U5.A1(VDDQ) U5.A8(VDDQ) U5.B2(VDD) U5.C1(VDDQ) U5.C9(VDDQ) U5.D2(VDDQ) U5.D9(VDD) U5.E9(VDDQ) U5.F1(VDDQ) U5.G7(VDD) U5.H2(VDDQ) U5.H9(VDDQ) U5.K2(VDD) U5.K8(VDD) U5.N1(VDD) U5.N9(VDD) U5.R1(VDD) U5.R9(VDD)
GND: C4.1 C6.1 C7.1 C8.1 C9.1 C10.1 C11.1 C12.1 C13.1 C14.1 C15.1 C16.1 C18.1 C19.1 C20.1 C21.1 C22.1 C23.1 C24.1 C25.1 C26.1 C27.1 C28.1 R16.2 R17.2 R18.2 R35.1 U4.A9(VSS) U4.B1(VSSQ) U4.B3(VSS) U4.B9(VSSQ) U4.D1(VSSQ) U4.D8(VSSQ) U4.E1(VSS) U4.E2(VSSQ) U4.E8(VSSQ) U4.F9(VSSQ) U4.G1(VSSQ) U4.G8(VSS) U4.G9(VSSQ) U4.J2(VSS) U4.J8(VSS) U4.M1(VSS) U4.M9(VSS) U4.P1(VSS) U4.P9(VSS) U4.T1(VSS) U4.T9(VSS) U5.A9(VSS) U5.B1(VSSQ) U5.B3(VSS) U5.B9(VSSQ) U5.D1(VSSQ) U5.D8(VSSQ) U5.E1(VSS) U5.E2(VSSQ) U5.E8(VSSQ) U5.F9(VSSQ) U5.G1(VSSQ) U5.G8(VSS) U5.G9(VSSQ) U5.J2(VSS) U5.J8(VSS) U5.M1(VSS) U5.M9(VSS) U5.P1(VSS) U5.P9(VSS) U5.T1(VSS) U5.T9(VSS)
VTTREF: C4.2 C5.1 C16.2 C17.1 C28.2 R27.1 R35.2 U4.H1(VREFDQ) U4.M8(VREFCA) U5.H1(VREFDQ) U5.M8(VREFCA)
DDR3_A0: R41.1
DDR3_A0_T: R41.2 U4.N3(A0) U5.N3(A0)
DDR3_A1: R21.1
DDR3_A1_T: R21.2 U4.P7(A1) U5.P7(A1)
DDR3_A2: R24.1
DDR3_A2_T: R24.2 U4.P3(A2) U5.P3(A2)
DDR3_A3: R30.1
DDR3_A3_T: R30.2 U4.N2(A3) U5.N2(A3)
DDR3_A4: R39.1
DDR3_A4_T: R39.2 U4.P8(A4) U5.P8(A4)
DDR3_A5: R42.1
DDR3_A5_T: R42.2 U4.P2(A5) U5.P2(A5)
DDR3_A6: R33.1
DDR3_A6_T: R33.2 U4.R8(A6) U5.R8(A6)
DDR3_A7: R40.1
DDR3_A7_T: R40.2 U4.R2(A7) U5.R2(A7)
DDR3_A8: R43.1
DDR3_A8_T: R43.2 U4.T8(A8) U5.T8(A8)
DDR3_A9: R23.1
DDR3_A9_T: R23.2 U4.R3(A9) U5.R3(A9)
DDR3_A10: R32.1
DDR3_A10_T: R32.2 U4.L7(A10/AP) U5.L7(A10/AP)
DDR3_A11: R38.1
DDR3_A11_T: R38.2 U4.R7(A11) U5.R7(A11)
DDR3_A12: R20.1
DDR3_A12_T: R20.2 U4.N7(A12/BC#) U5.N7(A12/BC#)
DDR3_BA0: R29.1
DDR3_BA0_T: R29.2 U4.M2(BA0) U5.M2(BA0)
DDR3_BA1: R22.1
DDR3_BA1_T: R22.2 U4.N8(BA1) U5.N8(BA1)
DDR3_BA2: R25.1
DDR3_BA2_T: R25.2 U4.M3(BA2) U5.M3(BA2)
DDR3_CAS: R37.1
DDR3_CAS_T: R37.2 U4.K3(CAS#) U5.K3(CAS#)
DDR3_CKE: R34.1
DDR3_CKE_T: R34.2 U4.K9(CKE) U5.K9(CKE)
DDR3_CLK_N: R31.1 U4.K7(CK#) U5.K7(CK#)
DDR3_CLK_P: R31.2 U4.J7(CK) U5.J7(CK)
DDR3_D0: U4.E3(DQ0)
DDR3_D1: U4.F7(DQ1)
DDR3_D2: U4.F2(DQ2)
DDR3_D3: U4.F8(DQ3)
DDR3_D4: U4.H3(DQ4)
DDR3_D5: U4.H8(DQ5)
DDR3_D6: U4.G2(DQ6)
DDR3_D7: U4.H7(DQ7)
DDR3_D8: U4.D7(DQ8)
DDR3_D9: U4.C3(DQ9)
DDR3_D10: U4.C8(DQ10)
DDR3_D11: U4.C2(DQ11)
DDR3_D12: U4.A7(DQ12)
DDR3_D13: U4.A2(DQ13)
DDR3_D14: U4.B8(DQ14)
DDR3_D15: U4.A3(DQ15)
DDR3_D16: U5.E3(DQ0)
DDR3_D17: U5.F7(DQ1)
DDR3_D18: U5.F2(DQ2)
DDR3_D19: U5.F8(DQ3)
DDR3_D20: U5.H3(DQ4)
DDR3_D21: U5.H8(DQ5)
DDR3_D22: U5.G2(DQ6)
DDR3_D23: U5.H7(DQ7)
DDR3_D24: U5.D7(DQ8)
DDR3_D25: U5.C3(DQ9)
DDR3_D26: U5.C8(DQ10)
DDR3_D27: U5.C2(DQ11)
DDR3_D28: U5.A7(DQ12)
DDR3_D29: U5.A2(DQ13)
DDR3_D30: U5.B8(DQ14)
DDR3_D31: U5.A3(DQ15)
DDR3_DM0: U4.E7(LDM)
DDR3_DM1: U4.D3(UDM)
DDR3_DM2: U5.E7(LDM)
DDR3_DM3: U5.D3(UDM)
DDR3_DQS0_N: U4.G3(LDQS#)
DDR3_DQS0_P: U4.F3(LDQS)
DDR3_DQS1_N: U4.B7(UDQS#)
DDR3_DQS1_P: U4.C7(UDQS)
DDR3_DQS2_N: U5.G3(LDQS#)
DDR3_DQS2_P: U5.F3(LDQS)
DDR3_DQS3_N: U5.B7(UDQS#)
DDR3_DQS3_P: U5.C7(UDQS)
DDR3_ODT: R36.1
DDR3_ODT_T: R36.2 U4.K1(ODT) U5.K1(ODT)
DDR3_RAS: R19.1
DDR3_RAS_T: R19.2 U4.J3(RAS#) U5.J3(RAS#)
DDR3_RESET: R16.1 U4.T2(RESET#) U5.T2(RESET#)
DDR3_S0: R28.1
DDR3_S0_T: R28.2 U4.L2(CS#) U5.L2(CS#)
DDR3_WE: R26.1
DDR3_WE_T: R26.2 U4.L3(WE#) U5.L3(WE#)
NetR17_1: R17.1 U4.L8(ZQ)
NetR18_1: R18.1 U5.L8(ZQ)

Not connected (* = marked no-connect by the designer): U4 J1(NC)* J9(NC)* L1(NC)* L9(NC)* M7(NC)* T3(NC)* T7(NC)*; U5 J1(NC)* J9(NC)* L1(NC)* L9(NC)* M7(NC)* T3(NC)* T7(NC)*

### Layout directives
net class DQ2: DDR3_D16, DDR3_D17, DDR3_D18, DDR3_D19, DDR3_D20, DDR3_D21, DDR3_D22, DDR3_D23, DDR3_DM2
net class DQ3: DDR3_D24, DDR3_D25, DDR3_D26, DDR3_D27, DDR3_D28, DDR3_D29, DDR3_D30, DDR3_D31, DDR3_DM3
net class DQ0: DDR3_D0, DDR3_D1, DDR3_D2, DDR3_D3, DDR3_D4, DDR3_D5, DDR3_D6, DDR3_D7, DDR3_DM0
net class DQ1: DDR3_D8, DDR3_D9, DDR3_D10, DDR3_D11, DDR3_D12, DDR3_D13, DDR3_D14, DDR3_D15, DDR3_DM1
differential pair; differential pair class DQS0: DDR3_DQS0_N, DDR3_DQS0_P
differential pair; differential pair class DQS1: DDR3_DQS1_N, DDR3_DQS1_P
differential pair; differential pair class DQS2: DDR3_DQS2_N, DDR3_DQS2_P
differential pair; differential pair class DQS3: DDR3_DQS3_N, DDR3_DQS3_P
differential pair; differential pair class DDR3_CLK: DDR3_CLK_N, DDR3_CLK_P
net class DDR3 ADDR: DDR3_A0_T, DDR3_A1_T, DDR3_A2_T, DDR3_A3_T, DDR3_A4_T, DDR3_A5_T, DDR3_A6_T, DDR3_A7_T, DDR3_A8_T, DDR3_A9_T, DDR3_A10_T, DDR3_A11_T, DDR3_A12_T, DDR3_BA0_T, DDR3_BA1_T, DDR3_BA2_T, DDR3_CAS_T, DDR3_CKE_T, DDR3_ODT_T, DDR3_RAS_T, DDR3_S0_T, DDR3_WE_T

### Library data of the parts
C4 C5 C16 C17 = CAP 10nF 50V X7R 0402: House Part Number: C-10nF-0402-002; Manufacturer: Murata; Manufacturer Part Number: GRM155R71H103KA88J; Voltage Rating: 50V; Package: 0402; Value: 10nF; Supplier 1: Digi-Key; Supplier Part Number 1: 490-6351-1-ND
C6 C11 C18 C23 C28 = CAP 4.7uF 6.3V X5R 0402: as C30 on sheet FPGA_PWR; Package: 0402; Value: 4.7uF; Supplier 1: Digi-Key; Supplier Part Number 1: 490-5915-1-ND
C7-C10 C12-C15 C19-C22 C24-C27 = CAP 470nF 6.3V X5R 0201: as C32 on sheet FPGA_PWR; Package: 0201; Value: 470nF; Supplier 1: Digi-Key; Supplier Part Number 1: 490-10409-1-ND
R16 = RES 4.7K OHM 1% 1/20W 0201: House Part Number: R-4.7K-0201-1%-001; Manufacturer: Yageo; Manufacturer Part Number: RC0201FR-074K7L; Tolerance: 1%; Package: 0201; Supplier 1: Digi-Key; Supplier Part Number 1: 311-4.70KMTR-ND; Value: 4.7K
R17 R18 = RES 240 OHM 1% 1/16W 0402: House Part Number: R-240-0402-1%-001; Manufacturer: Yageo; Manufacturer Part Number: RC0402FR-07240RL; Tolerance: 1%; Package: 0402; Value: 240; Supplier 1: Digi-Key; Supplier Part Number 1: 311-240LRTR-ND
R19-R26 R28-R30 R32-R34 R36-R43 = RES 33 OHM 1% 1/20W 0201: House Part Number: R-33-0201-1%-001; Manufacturer: Stackpole Electronics; Manufacturer Part Number: RMCF0201FT33R0; Tolerance: 1%; Package: 0201; Value: 33; Supplier 1: Digi-Key; Supplier Part Number 1: RMCF0201FT33R0CT-ND
R27 R35 = RES 1K OHM 1% 1/10W 0402: House Part Number: R-1K-0402-1%-001; Manufacturer: Yageo; Manufacturer Part Number: RC0402FR-071KL; Tolerance: 1%; Package: 0402; Value: 1K; Supplier 1: Digi-Key; Supplier Part Number 1: 311-1.00KLRCT-ND
R31 = RES 82 OHM 1% 1/16W 0402: House Part Number: R-82-0402-1%-001; Manufacturer: Yageo; Manufacturer Part Number: RC0402FR-0782RL; Tolerance: 1%; Package: 0402; Supplier 1: Digi-Key; Supplier Part Number 1: 311-82LRCT-ND; Value: 82
U4 U5 = IC DDR3 MT41K64M16JT-15E: 1Gb DDR3-1333 SDRAM, 64Mb x 16, 1.5ns, 1.35V, 0 to 95 degC, 96-Ball FBGA, Pb-Free; Manufacturer: Micron; House Part Number: MT41K64M16TW-107:J; Package: 96-FBGA; Manufacturer Part Number: MT41K64M16TW-107:J; Supplier 1: Digi-Key; Supplier Part Number 1: 557-2010-1-ND

## Sheet PWR.SchDoc
size A4; SheetNumber: 8; SheetTotal: 8
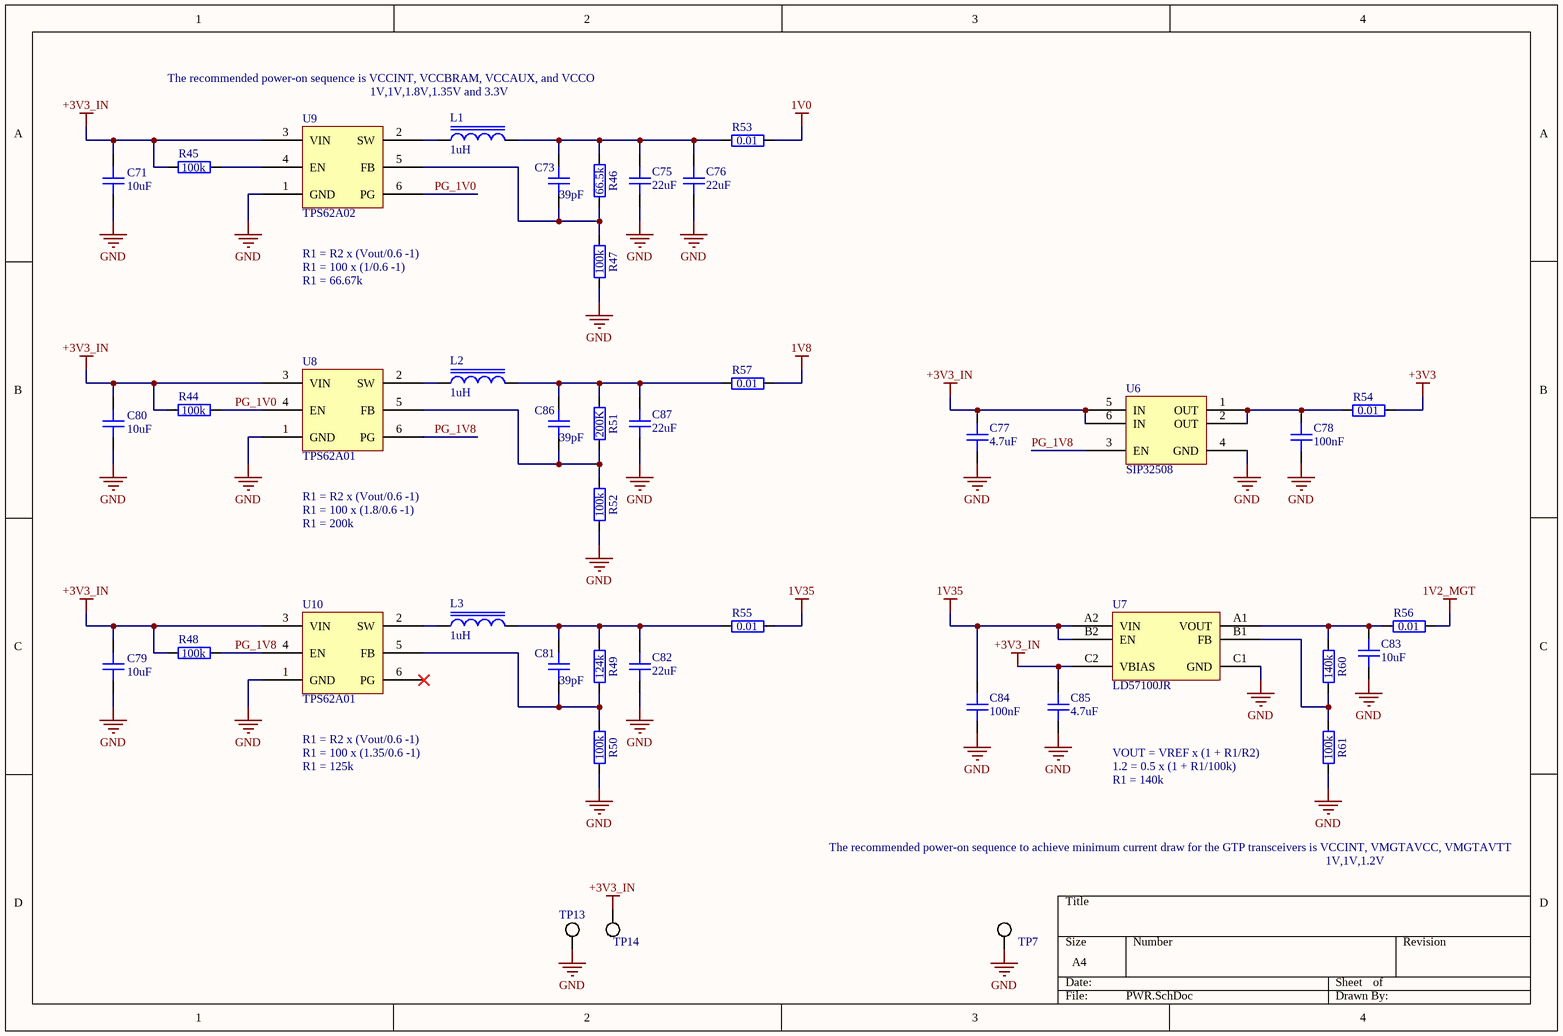
[diagram p7: PWR.SchDoc]

### Parts
C71  10uF  [GEN_C_0603]
C73  39pF  [GEN_C_0402]
C75  22uF  [GEN_C_0805]
C76  22uF  [GEN_C_0805]
C77  4.7uF  [GEN_C_0402]
C78  100nF  [GEN_C_0402]
C79  10uF  [GEN_C_0603]
C80  10uF  [GEN_C_0603]
C81  39pF  [GEN_C_0402]
C82  22uF  [GEN_C_0805]
C83  10uF  [GEN_C_0603]
C84  100nF  [GEN_C_0402]
C85  4.7uF  [GEN_C_0402]
C86  39pF  [GEN_C_0402]
C87  22uF  [GEN_C_0805]
L1  1uH  [GEN_L_1210]
L2  1uH  [GEN_L_1210]
L3  1uH  [GEN_L_1210]
R44  100k  [GEN_R_0402]
R45  100k  [GEN_R_0402]
R46  66.5k  [GEN_R_0402]
R47  100k  [GEN_R_0402]
R48  100k  [GEN_R_0402]
R49  124k  [GEN_R_0402]
R50  100k  [GEN_R_0402]
R51  200K  [GEN_R_0402]
R52  100k  [GEN_R_0402]
R53  0.01  [GEN_R_0603]
R54  0.01  [GEN_R_0603]
R55  0.01  [GEN_R_0603]
R56  0.01  [GEN_R_0603]
R57  0.01  [GEN_R_0603]
R60  140k  [GEN_R_0402]
R61  100k  [GEN_R_0402]
TP7  PCB  [GEN_TP_PCB]  (value not drawn)  (no BOM)
TP13  PCB  [GEN_TP_PCB]  (value not drawn)  (no BOM)
TP14  PCB  [GEN_TP_PCB]  (value not drawn)  (no BOM)
U6  SIP32508  [VISH_TSOT6]
U7  LD57100JR  [ST_FlipChip6]
U8  TPS62A01  [TI_SOT563_DRL0006A]
U9  TPS62A02  [TI_SOT563_DRL0006A]
U10  TPS62A01  [TI_SOT563_DRL0006A]

### Nets
1V0: R53.2
1V2_MGT: R56.2
1V8: R57.2
1V35: C84.2 R55.2 U7.A2(VIN) U7.B2(EN)
+3V3: R54.2
+3V3_IN: C71.2 C77.2 C79.2 C80.2 C85.2 R44.2 R45.2 R48.2 TP14.1 U6.5(IN) U6.6(IN) U7.C2(VBIAS) U8.3(VIN) U9.3(VIN) U10.3(VIN)
GND: C71.1 C75.1 C76.1 C77.1 C78.1 C79.1 C80.1 C82.1 C83.1 C84.1 C85.1 C87.1 R47.1 R50.1 R52.1 R61.1 TP7.1 TP13.1 U6.4(GND) U7.C1(GND) U8.1(GND) U9.1(GND) U10.1(GND)
PG_1V0: R44.1 U8.4(EN) U9.6(PG)
PG_1V8: R48.1 U6.3(EN) U8.6(PG) U10.4(EN)
NetC73_1: C73.1 R46.1 R47.2 U9.5(FB)
NetC73_2: C73.2 C75.2 C76.2 L1.2 R46.2 R53.1
NetC78_2: C78.2 R54.1 U6.1(OUT) U6.2(OUT)
NetC81_1: C81.1 R49.1 R50.2 U10.5(FB)
NetC81_2: C81.2 C82.2 L3.2 R49.2 R55.1
NetC83_2: C83.2 R56.1 R60.2 U7.A1(VOUT)
NetC86_1: C86.1 R51.1 R52.2 U8.5(FB)
NetC86_2: C86.2 C87.2 L2.2 R51.2 R57.1
NetL1_1: L1.1 U9.2(SW)
NetL2_1: L2.1 U8.2(SW)
NetL3_1: L3.1 U10.2(SW)
NetR45_1: R45.1 U9.4(EN)
NetR60_1: R60.1 R61.2 U7.B1(FB)

Not connected (* = marked no-connect by the designer): U10 6(PG)*

### Notes on the sheet
- The recommended power-on sequence is VCCINT, VCCBRAM, VCCAUX, and VCCO
- 1V,1V,1.8V,1.35V and 3.3V
- R1 = R2 x (Vout/0.6 -1)
- R1 = 100 x (1/0.6 -1)
- R1 = 66.67k
- R1 = 100 x (1.8/0.6 -1)
- R1 = 200k
- R1 = 100 x (1.35/0.6 -1)
- R1 = 125k
- VOUT = VREF x (1 + R1/R2)
- 1.2 = 0.5 x (1 + R1/100k)
- R1 = 140k
- The recommended power-on sequence to achieve minimum current draw for the GTP transceivers is VCCINT, VMGTAVCC, VMGTAVTT
- 1V,1V,1.2V

### Library data of the parts
C71 C79 C80 C83 = CAP 10uF 10V X5R 0603: Voltage Rating: 10V; Package: 0402; Supplier 1: Digi-Key; Supplier Part Number 1: 490-10474-1-ND; Value: 10uF
C73 C81 C86 = CAP 39pF 50V C0G 0402: Temperature Coefficient: C0G; Voltage Rating: 50V; Package: 0402; Value: 39pF; Supplier 1: Digi-Key; Supplier Part Number 1: 399-C0402C390J5GAC7867CT-ND
C75 C76 C82 C87 = CAP 22uF 25V X5R 0805: Voltage Rating: 25V; Package: 0805; Value: 22uF; Supplier 1: Digi-Key; Supplier Part Number 1: 490-10749-1-ND
C77 C85 = CAP 4.7uF 6.3V X5R 0402: Voltage Rating: 6.3V; Package: 0402; Value: 4.7uF; Supplier 1: Digi-Key; Supplier Part Number 1: 490-5915-1-ND
C78 C84 = CAP 100nF 16V X7R 0402: Voltage Rating: 16V; Package: 0402; Supplier 1: Digi-Key; Supplier Part Number 1: 490-4759-1-ND; Value: 100nF
L1-L3 = IND 1uH 5.5A 32 MOHM 1210: Value: 1uH; Supplier 1: Digi-Key; Supplier Part Number 1: 118-SRP3212-1R0MCT-ND
R44 R45 R47 R48 R50 R52 R61 = RES 100K OHM 1% 1/10W 0402: Tolerance: 1%; Power Rating: 0.1W; Package: 0402; Value: 100k; Supplier 1: Digi-Key; Supplier Part Number 1: 311-100KLRCT-ND
R46 = RES 66.5K OHM 1% 1/16W 0402: Tolerance: 1%; Power Rating: 0.0625W; Package: 0402; Value: 66.5k; Supplier 1: Digi-Key; Supplier Part Number 1: YAG3209CT-ND
R49 = RES 124K OHM 1% 1/10W 0402: Tolerance: 1%; Power Rating: 0.1W; Package: 0402; Value: 124k; Supplier 1: Digi-Key; Supplier Part Number 1: 311-124KLRCT-ND
R51 = RES 200K OHM 1% 1/16W 0402: Tolerance: 1%; Power Rating: 0.0625W; Package: 0402; Value: 200K; Supplier 1: Digi-Key; Supplier Part Number 1: 311-200KLRCT-ND
R53-R57 = RES 0.01 OHM 1% 1/4W 0603: Tolerance: 1%; Power Rating: 0.25W; Supplier 1: Digi-Key; Supplier Part Number 1: 408-1404-1-ND; Value: 0.01; Package: 0603
R60 = RES 140K OHM 1% 1/10W 0402: Tolerance: 1%; Power Rating: 0.1W; Package: 0402; Value: 140k; Supplier 1: Digi-Key; Supplier Part Number 1: YAG2978CT-ND
TP7 TP13 TP14 = TP PCB 1mm
U6 = IC SWITCH LOAD SIP32508: Supplier 1: Digi-Key; Supplier Part Number 1: SIP32508DT-T1-GE3CT-ND
U7 = IC LDO LD57100JR: Supplier 1: Digi-Key; Supplier Part Number 1: 497-LD57100JRCT-ND
U8 U10 = IC BUCK TPS62A01: Supplier 1: Mouser; Supplier Part Number 1: 595-TPS62A01DRLR
U9 = IC BUCK TPS62A02: Supplier 1: Mouser; Supplier Part Number 1: 595-TPS62A02DRLR

## Nets that join several sheets
1V0: FPGA_PWR (30 pins), PWR (R53.2)
1V2_MGT: FPGA_MGT (R11.1), FPGA_PWR (8 pins), PWR (R56.2)
1V8: Connectors (JM2.91), FPGA_CFG (8 pins), FPGA_PWR (16 pins), PWR (R57.2)
1V35: FPGA_Banks_DDR3 (R58.2), FPGA_CFG (5 pins), FPGA_PWR (27 pins), DDR3L (59 pins), PWR (C84.2 R55.2 U7.A2 U7.B2)
+3V3: FPGA_Bank_IO (C72.1 Y1.1 Y1.4), FPGA_PWR (13 pins), PWR (R54.2)
+3V3_IN: Connectors (5 pins), PWR (15 pins)
AGND: FPGA_CFG (5 pins), FPGA_PWR (C64.1 U1.J9)
GND: Connectors (54 pins), FPGA_Bank_IO (C72.2 Y1.2), FPGA_Banks_DDR3 (TP5.1), FPGA_CFG (13 pins), FPGA_PWR (116 pins), DDR3L (69 pins), PWR (23 pins)
VTTREF: FPGA_Banks_DDR3 (U1.C12 U1.F18), DDR3L (11 pins)
ACQ_EN: Connectors (JM2.51), FPGA_Bank_IO (U1.M4)
ADC_CSn: Connectors (JM2.65), FPGA_Bank_IO (U1.J4)
ADC_PD: Connectors (JM2.61), FPGA_Bank_IO (U1.L4)
ADC_PG: Connectors (JM2.67), FPGA_Bank_IO (U1.R6)
ADC_RSTn: Connectors (JM2.63), FPGA_Bank_IO (U1.M6)
ADC_SCLK: Connectors (JM2.41), FPGA_Bank_IO (U1.J6)
ADC_SDATA: Connectors (JM2.43), FPGA_Bank_IO (U1.L5)
ATTEN_1: Connectors (JM2.38), FPGA_Bank_IO (U1.N6)
ATTEN_2: Connectors (JM2.48), FPGA_Bank_IO (U1.M2)
ATTEN_3: Connectors (JM2.56), FPGA_Bank_IO (U1.P1)
ATTEN_4: Connectors (JM2.64), FPGA_Bank_IO (U1.K1)
D1A_N: Connectors (JM1.58), FPGA_Bank_IO (R6.1 U1.V4)
D1A_P: Connectors (JM1.56), FPGA_Bank_IO (R6.2 U1.U4)
D1B_N: Connectors (JM1.62), FPGA_Bank_IO (R8.1 U1.V2)
D1B_P: Connectors (JM1.60), FPGA_Bank_IO (R8.2 U1.V3)
D2A_N: Connectors (JM1.68), FPGA_Bank_IO (R1.2 U1.U7)
D2A_P: Connectors (JM1.66), FPGA_Bank_IO (R1.1 U1.V6)
D2B_N: Connectors (JM1.72), FPGA_Bank_IO (R5.2 U1.V8)
D2B_P: Connectors (JM1.70), FPGA_Bank_IO (R5.1 U1.V7)
D3A_N: Connectors (JM1.82), FPGA_Bank_IO (R3.1 U1.T5)
D3A_P: Connectors (JM1.80), FPGA_Bank_IO (R3.2 U1.R5)
D3B_N: Connectors (JM1.88), FPGA_Bank_IO (R7.2 U1.T4)
D3B_P: Connectors (JM1.86), FPGA_Bank_IO (R7.1 U1.T3)
D4A_N: Connectors (JM1.96), FPGA_Bank_IO (R4.2 U1.U6)
D4A_P: Connectors (JM1.94), FPGA_Bank_IO (R4.1 U1.U5)
D4B_N: Connectors (JM1.100), FPGA_Bank_IO (R2.2 U1.R7)
D4B_P: Connectors (JM1.98), FPGA_Bank_IO (R2.1 U1.T7)
DC_CPL_1: Connectors (JM2.42), FPGA_Bank_IO (U1.P3)
DC_CPL_2: Connectors (JM2.52), FPGA_Bank_IO (U1.N2)
DC_CPL_3: Connectors (JM2.58), FPGA_Bank_IO (U1.T2)
DC_CPL_4: Connectors (JM2.66), FPGA_Bank_IO (U1.K3)
DDR3_A0: FPGA_Banks_DDR3 (U1.T12), DDR3L (R41.1)
DDR3_A1: FPGA_Banks_DDR3 (U1.T15), DDR3L (R21.1)
DDR3_A2: FPGA_Banks_DDR3 (U1.T14), DDR3L (R24.1)
DDR3_A3: FPGA_Banks_DDR3 (U1.V11), DDR3L (R30.1)
DDR3_A4: FPGA_Banks_DDR3 (U1.V12), DDR3L (R39.1)
DDR3_A5: FPGA_Banks_DDR3 (U1.V13), DDR3L (R42.1)
DDR3_A6: FPGA_Banks_DDR3 (U1.T18), DDR3L (R33.1)
DDR3_A7: FPGA_Banks_DDR3 (U1.V16), DDR3L (R40.1)
DDR3_A8: FPGA_Banks_DDR3 (U1.V17), DDR3L (R43.1)
DDR3_A9: FPGA_Banks_DDR3 (U1.T17), DDR3L (R23.1)
DDR3_A10: FPGA_Banks_DDR3 (U1.N18), DDR3L (R32.1)
DDR3_A11: FPGA_Banks_DDR3 (U1.V14), DDR3L (R38.1)
DDR3_A12: FPGA_Banks_DDR3 (U1.T13), DDR3L (R20.1)
DDR3_BA0: FPGA_Banks_DDR3 (U1.N17), DDR3L (R29.1)
DDR3_BA1: FPGA_Banks_DDR3 (U1.R18), DDR3L (R22.1)
DDR3_BA2: FPGA_Banks_DDR3 (U1.M17), DDR3L (R25.1)
DDR3_CAS: FPGA_Banks_DDR3 (U1.K18), DDR3L (R37.1)
DDR3_CKE: FPGA_Banks_DDR3 (U1.L18), DDR3L (R34.1)
DDR3_CLK_N: FPGA_Banks_DDR3 (U1.V9), DDR3L (R31.1 U4.K7 U5.K7)
DDR3_CLK_P: FPGA_Banks_DDR3 (U1.U9), DDR3L (R31.2 U4.J7 U5.J7)
DDR3_D0: FPGA_Banks_DDR3 (U1.D14), DDR3L (U4.E3)
DDR3_D1: FPGA_Banks_DDR3 (U1.A12), DDR3L (U4.F7)
DDR3_D2: FPGA_Banks_DDR3 (U1.A15), DDR3L (U4.F2)
DDR3_D3: FPGA_Banks_DDR3 (U1.C13), DDR3L (U4.F8)
DDR3_D4: FPGA_Banks_DDR3 (U1.A14), DDR3L (U4.H3)
DDR3_D5: FPGA_Banks_DDR3 (U1.A13), DDR3L (U4.H8)
DDR3_D6: FPGA_Banks_DDR3 (U1.D13), DDR3L (U4.G2)
DDR3_D7: FPGA_Banks_DDR3 (U1.B14), DDR3L (U4.H7)
DDR3_D8: FPGA_Banks_DDR3 (U1.A10), DDR3L (U4.D7)
DDR3_D9: FPGA_Banks_DDR3 (U1.C9), DDR3L (U4.C3)
DDR3_D10: FPGA_Banks_DDR3 (U1.D8), DDR3L (U4.C8)
DDR3_D11: FPGA_Banks_DDR3 (U1.D11), DDR3L (U4.C2)
DDR3_D12: FPGA_Banks_DDR3 (U1.C8), DDR3L (U4.A7)
DDR3_D13: FPGA_Banks_DDR3 (U1.C11), DDR3L (U4.A2)
DDR3_D14: FPGA_Banks_DDR3 (U1.D9), DDR3L (U4.B8)
DDR3_D15: FPGA_Banks_DDR3 (U1.B11), DDR3L (U4.A3)
DDR3_D16: FPGA_Banks_DDR3 (U1.B17), DDR3L (U5.E3)
DDR3_D17: FPGA_Banks_DDR3 (U1.D16), DDR3L (U5.F7)
DDR3_D18: FPGA_Banks_DDR3 (U1.E16), DDR3L (U5.F2)
DDR3_D19: FPGA_Banks_DDR3 (U1.E17), DDR3L (U5.F8)
DDR3_D20: FPGA_Banks_DDR3 (U1.C16), DDR3L (U5.H3)
DDR3_D21: FPGA_Banks_DDR3 (U1.C18), DDR3L (U5.H8)
DDR3_D22: FPGA_Banks_DDR3 (U1.D15), DDR3L (U5.G2)
DDR3_D23: FPGA_Banks_DDR3 (U1.C17), DDR3L (U5.H7)
DDR3_D24: FPGA_Banks_DDR3 (U1.G17), DDR3L (U5.D7)
DDR3_D25: FPGA_Banks_DDR3 (U1.F17), DDR3L (U5.C3)
DDR3_D26: FPGA_Banks_DDR3 (U1.H17), DDR3L (U5.C8)
DDR3_D27: FPGA_Banks_DDR3 (U1.E18), DDR3L (U5.C2)
DDR3_D28: FPGA_Banks_DDR3 (U1.H16), DDR3L (U5.A7)
DDR3_D29: FPGA_Banks_DDR3 (U1.F14), DDR3L (U5.A2)
DDR3_D30: FPGA_Banks_DDR3 (U1.H18), DDR3L (U5.B8)
DDR3_D31: FPGA_Banks_DDR3 (U1.G14), DDR3L (U5.A3)
DDR3_DM0: FPGA_Banks_DDR3 (U1.B12), DDR3L (U4.E7)
DDR3_DM1: FPGA_Banks_DDR3 (U1.B10), DDR3L (U4.D3)
DDR3_DM2: FPGA_Banks_DDR3 (U1.D18), DDR3L (U5.E7)
DDR3_DM3: FPGA_Banks_DDR3 (U1.G16), DDR3L (U5.D3)
DDR3_DQS0_N: FPGA_Banks_DDR3 (U1.B15), DDR3L (U4.G3)
DDR3_DQS0_P: FPGA_Banks_DDR3 (U1.C14), DDR3L (U4.F3)
DDR3_DQS1_N: FPGA_Banks_DDR3 (U1.A9), DDR3L (U4.B7)
DDR3_DQS1_P: FPGA_Banks_DDR3 (U1.B9), DDR3L (U4.C7)
DDR3_DQS2_N: FPGA_Banks_DDR3 (U1.A17), DDR3L (U5.G3)
DDR3_DQS2_P: FPGA_Banks_DDR3 (U1.B16), DDR3L (U5.F3)
DDR3_DQS3_N: FPGA_Banks_DDR3 (U1.F15), DDR3L (U5.B7)
DDR3_DQS3_P: FPGA_Banks_DDR3 (U1.G15), DDR3L (U5.C7)
DDR3_ODT: FPGA_Banks_DDR3 (U1.K17), DDR3L (R36.1)
DDR3_RAS: FPGA_Banks_DDR3 (U1.K15), DDR3L (R19.1)
DDR3_RESET: FPGA_Banks_DDR3 (U1.U11), DDR3L (R16.1 U4.T2 U5.T2)
DDR3_S0: FPGA_Banks_DDR3 (U1.M15), DDR3L (R28.1)
DDR3_WE: FPGA_Banks_DDR3 (U1.M16), DDR3L (R26.1)
FCLK_N: Connectors (JM1.77), FPGA_Bank_IO (R9.1 U1.U1)
FCLK_P: Connectors (JM1.75), FPGA_Bank_IO (R9.2 U1.U2)
FE_EN: Connectors (JM2.53), FPGA_Bank_IO (U1.K6)
FE_PG: Connectors (JM2.45), FPGA_Bank_IO (U1.J5)
LCLK_N: Connectors (JM1.61), FPGA_Bank_IO (R10.1 U1.R1)
LCLK_P: Connectors (JM1.59), FPGA_Bank_IO (R10.2 U1.R2)
LED: Connectors (R62.1), FPGA_Banks_DDR3 (U1.U17)
MGT_CLK1_N: Connectors (JM3.31), FPGA_MGT (U1.B5)
MGT_CLK1_P: Connectors (JM3.33), FPGA_MGT (U1.B6)
MGT_RX0_N: Connectors (JM3.8), FPGA_MGT (U1.E3)
MGT_RX0_P: Connectors (JM3.10), FPGA_MGT (U1.E4)
MGT_RX1_N: Connectors (JM3.14), FPGA_MGT (U1.A3)
MGT_RX1_P: Connectors (JM3.16), FPGA_MGT (U1.A4)
MGT_RX2_N: Connectors (JM3.20), FPGA_MGT (U1.C3)
MGT_RX2_P: Connectors (JM3.22), FPGA_MGT (U1.C4)
MGT_RX3_N: Connectors (JM3.26), FPGA_MGT (U1.G3)
MGT_RX3_P: Connectors (JM3.28), FPGA_MGT (U1.G4)
MGT_TX0_N: Connectors (JM3.7), FPGA_MGT (U1.H1)
MGT_TX0_P: Connectors (JM3.9), FPGA_MGT (U1.H2)
MGT_TX1_N: Connectors (JM3.13), FPGA_MGT (U1.F1)
MGT_TX1_P: Connectors (JM3.15), FPGA_MGT (U1.F2)
MGT_TX2_N: Connectors (JM3.19), FPGA_MGT (U1.D1)
MGT_TX2_P: Connectors (JM3.21), FPGA_MGT (U1.D2)
MGT_TX3_N: Connectors (JM3.25), FPGA_MGT (U1.B1)
MGT_TX3_P: Connectors (JM3.27), FPGA_MGT (U1.B2)
OSC_OE: Connectors (JM2.47), FPGA_Bank_IO (U1.N3)
PERST#: Connectors (JM3.59), FPGA_Bank_IO (U1.L2)
PGA_CSn_1: Connectors (JM2.36), FPGA_Bank_IO (U1.M1)
PGA_CSn_2: Connectors (JM2.46), FPGA_Bank_IO (U1.M5)
PGA_CSn_3: Connectors (JM2.54), FPGA_Bank_IO (U1.R3)
PGA_CSn_4: Connectors (JM2.62), FPGA_Bank_IO (U1.P5)
PGA_SCLK: Connectors (JM2.34), FPGA_Bank_IO (U1.K2)
PGA_SDIO: Connectors (JM2.32), FPGA_Bank_IO (U1.L3)
PROBE_COMP: Connectors (JM2.44), FPGA_Bank_IO (U1.N1)
SCL: Connectors (JM2.57), FPGA_Bank_IO (U1.K5)
SDA: Connectors (JM2.55), FPGA_Bank_IO (U1.N4)
SPI_CS_1V35: FPGA_Banks_DDR3 (U1.L15), FPGA_CFG (Q1.3 R12.1)
SPI_DQ0_1V35: FPGA_Banks_DDR3 (U1.K16), FPGA_CFG (U3.2)
SPI_DQ1_1V35: FPGA_Banks_DDR3 (U1.L17), FPGA_CFG (U3.3)
SPI_DQ2_1V35: FPGA_Banks_DDR3 (U1.J15), FPGA_CFG (U3.4)
SPI_DQ3_1V35: FPGA_Banks_DDR3 (U1.J16), FPGA_CFG (U3.5)
SYNC: Connectors (JM1.93), FPGA_Bank_IO (U1.P6)
TCK: Connectors (JM2.99), FPGA_CFG (TP10.1 U1.F8)
TDI: Connectors (JM2.95), FPGA_CFG (TP8.1 U1.T9)
TDO: Connectors (JM2.97), FPGA_CFG (TP9.1 U1.T8)
TMS: Connectors (JM2.93), FPGA_CFG (TP11.1 U1.R8)